# EAGLE design nixie_controller (EAGLE 9.4.0)

## Sheet 1 of 4: Controll
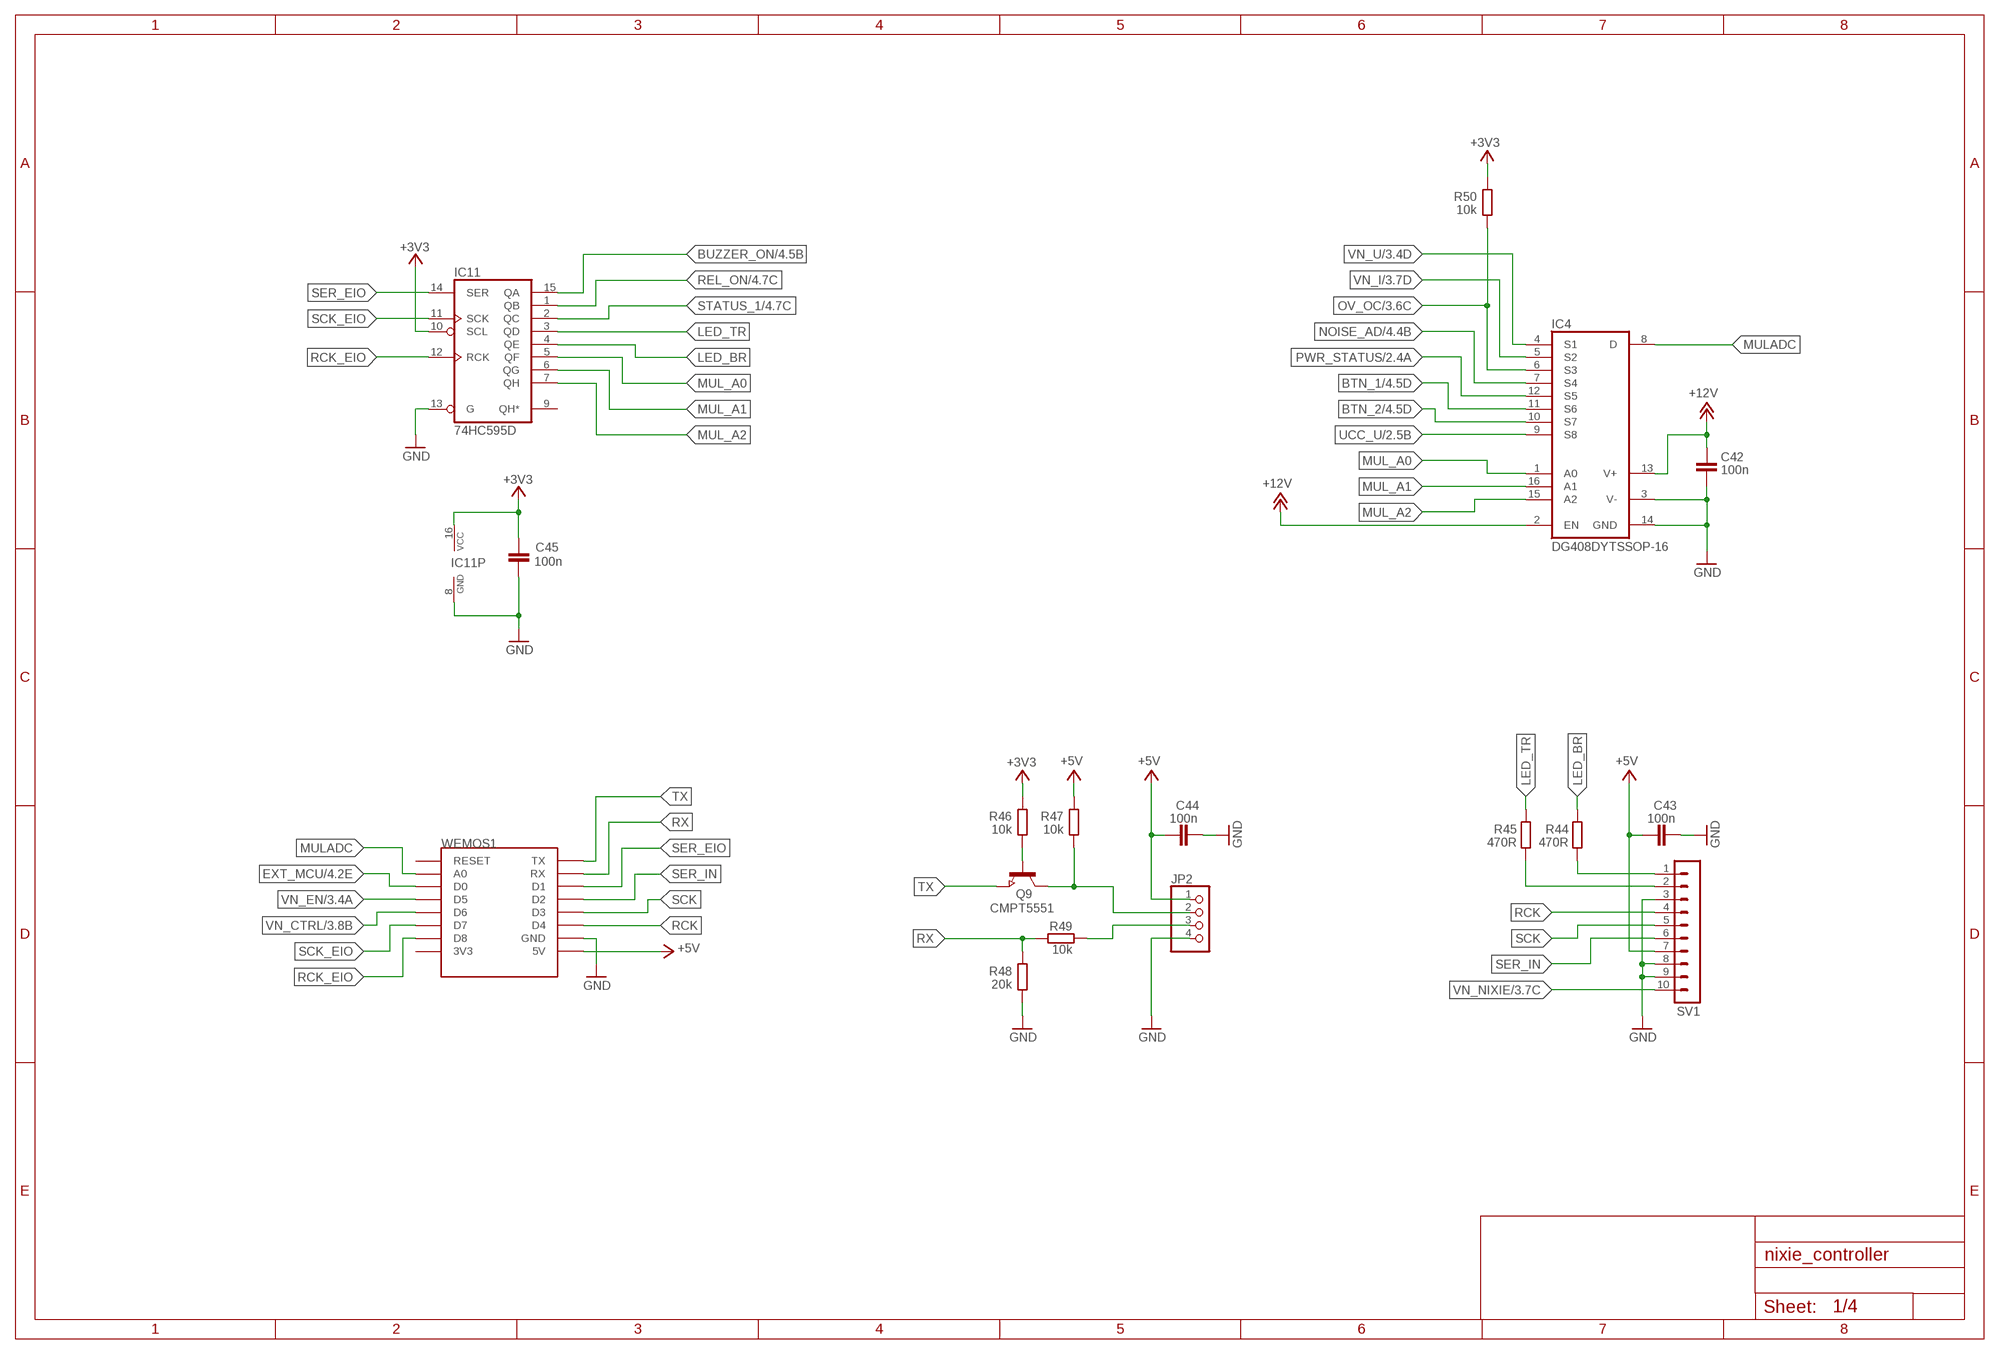
[diagram p0: schematic, sheet 1]

### Parts
C42  100n  C-EUC1206  [C1206]
C43  100n  C-EUC1206  [C1206]
C44  100n  C-EUC1206  [C1206]
C45  100n  C-EUC1206  [C1206]
IC4  DG408DYTSSOP-16  [TSSOP16]
IC11  74HC595D  [SO16]
JP2  PINHD-1X4/90  [1X04/90]
Q9  CMPT5551  NPN-TRANSISTOR_SOT23  [SOT23]
R44  470R  R-EU_R1206  [R1206]
R45  470R  R-EU_R1206  [R1206]
R46  10k  R-EU_R1206  [R1206]
R47  10k  R-EU_R1206  [R1206]
R48  20k  R-EU_R1206  [R1206]
R49  10k  R-EU_R1206  [R1206]
R50  10k  R-EU_R1206  [R1206]
SV1  MA10-1  [MA10-1]
WEMOS1  WEMOS-D1-MINI  [WEMOS-D1-MINI]

### Nets
+3V3: C45.1 IC11.10(SCL) IC11.16(VCC) R46.1 R50.1 ; also sheet 2,4
+5V: C43.1 C44.1 JP2.1 R47.1 SV1.7 WEMOS1.5V ; also sheet 2,3,4
+12V: C42.1 IC4.2(EN) IC4.13(V+) ; also sheet 2,4
BTN_1: IC4.11(S6) ; also sheet 4
BTN_2: IC4.10(S7) ; also sheet 4
BUZZER_ON: IC11.15(QA) ; also sheet 4
EXT_MCU: WEMOS1.D0 ; also sheet 4
GND: C42.2 C43.2 C44.2 C45.2 IC4.3(V-) IC4.14(GND) IC11.8(GND) IC11.13(G) JP2.4 R48.2 SV1.3 SV1.8 SV1.9 WEMOS1.GND ; also sheet 2,3,4
LED_B: R45.2 SV1.2
LED_BR: IC11.4(QE) R44.1
LED_T: R44.2 SV1.1
LED_TR: IC11.3(QD) R45.1
MUL_A0: IC4.1(A0) IC11.5(QF)
MUL_A1: IC4.16(A1) IC11.6(QG)
MUL_A2: IC4.15(A2) IC11.7(QH)
MULADC: IC4.8(D) WEMOS1.A0
N$60: Q9.1(B) R46.2
NOISE_AD: IC4.7(S4) ; also sheet 4
OV_OC: IC4.6(S3) R50.2 ; also sheet 3
PWR_STATUS: IC4.12(S5) ; also sheet 2
RCK: SV1.4 WEMOS1.D4
RCK_EIO: IC11.12(RCK) WEMOS1.D8
REL_ON: IC11.1(QB) ; also sheet 4
RX: R48.1 R49.1 WEMOS1.RX
RX_IN: JP2.3 R49.2
SCK: SV1.5 WEMOS1.D3
SCK_EIO: IC11.11(SCK) WEMOS1.D7
SER_EIO: IC11.14(SER) WEMOS1.D1
SER_IN: SV1.6 WEMOS1.D2
STATUS_1: IC11.2(QC) ; also sheet 4
TX: Q9.2(E) WEMOS1.TX
TX_IN: JP2.2 Q9.3(C) R47.2
UCC_U: IC4.9(S8) ; also sheet 2
VN_CTRL: WEMOS1.D6 ; also sheet 3
VN_EN: WEMOS1.D5 ; also sheet 3,4
VN_I: IC4.5(S2) ; also sheet 3
VN_NIXIE [VN]: SV1.10 ; also sheet 3
VN_U: IC4.4(S1) ; also sheet 3
Unconnected: IC11.9(QH*) WEMOS1.3V3 WEMOS1.RESET

## Sheet 2 of 4: Power
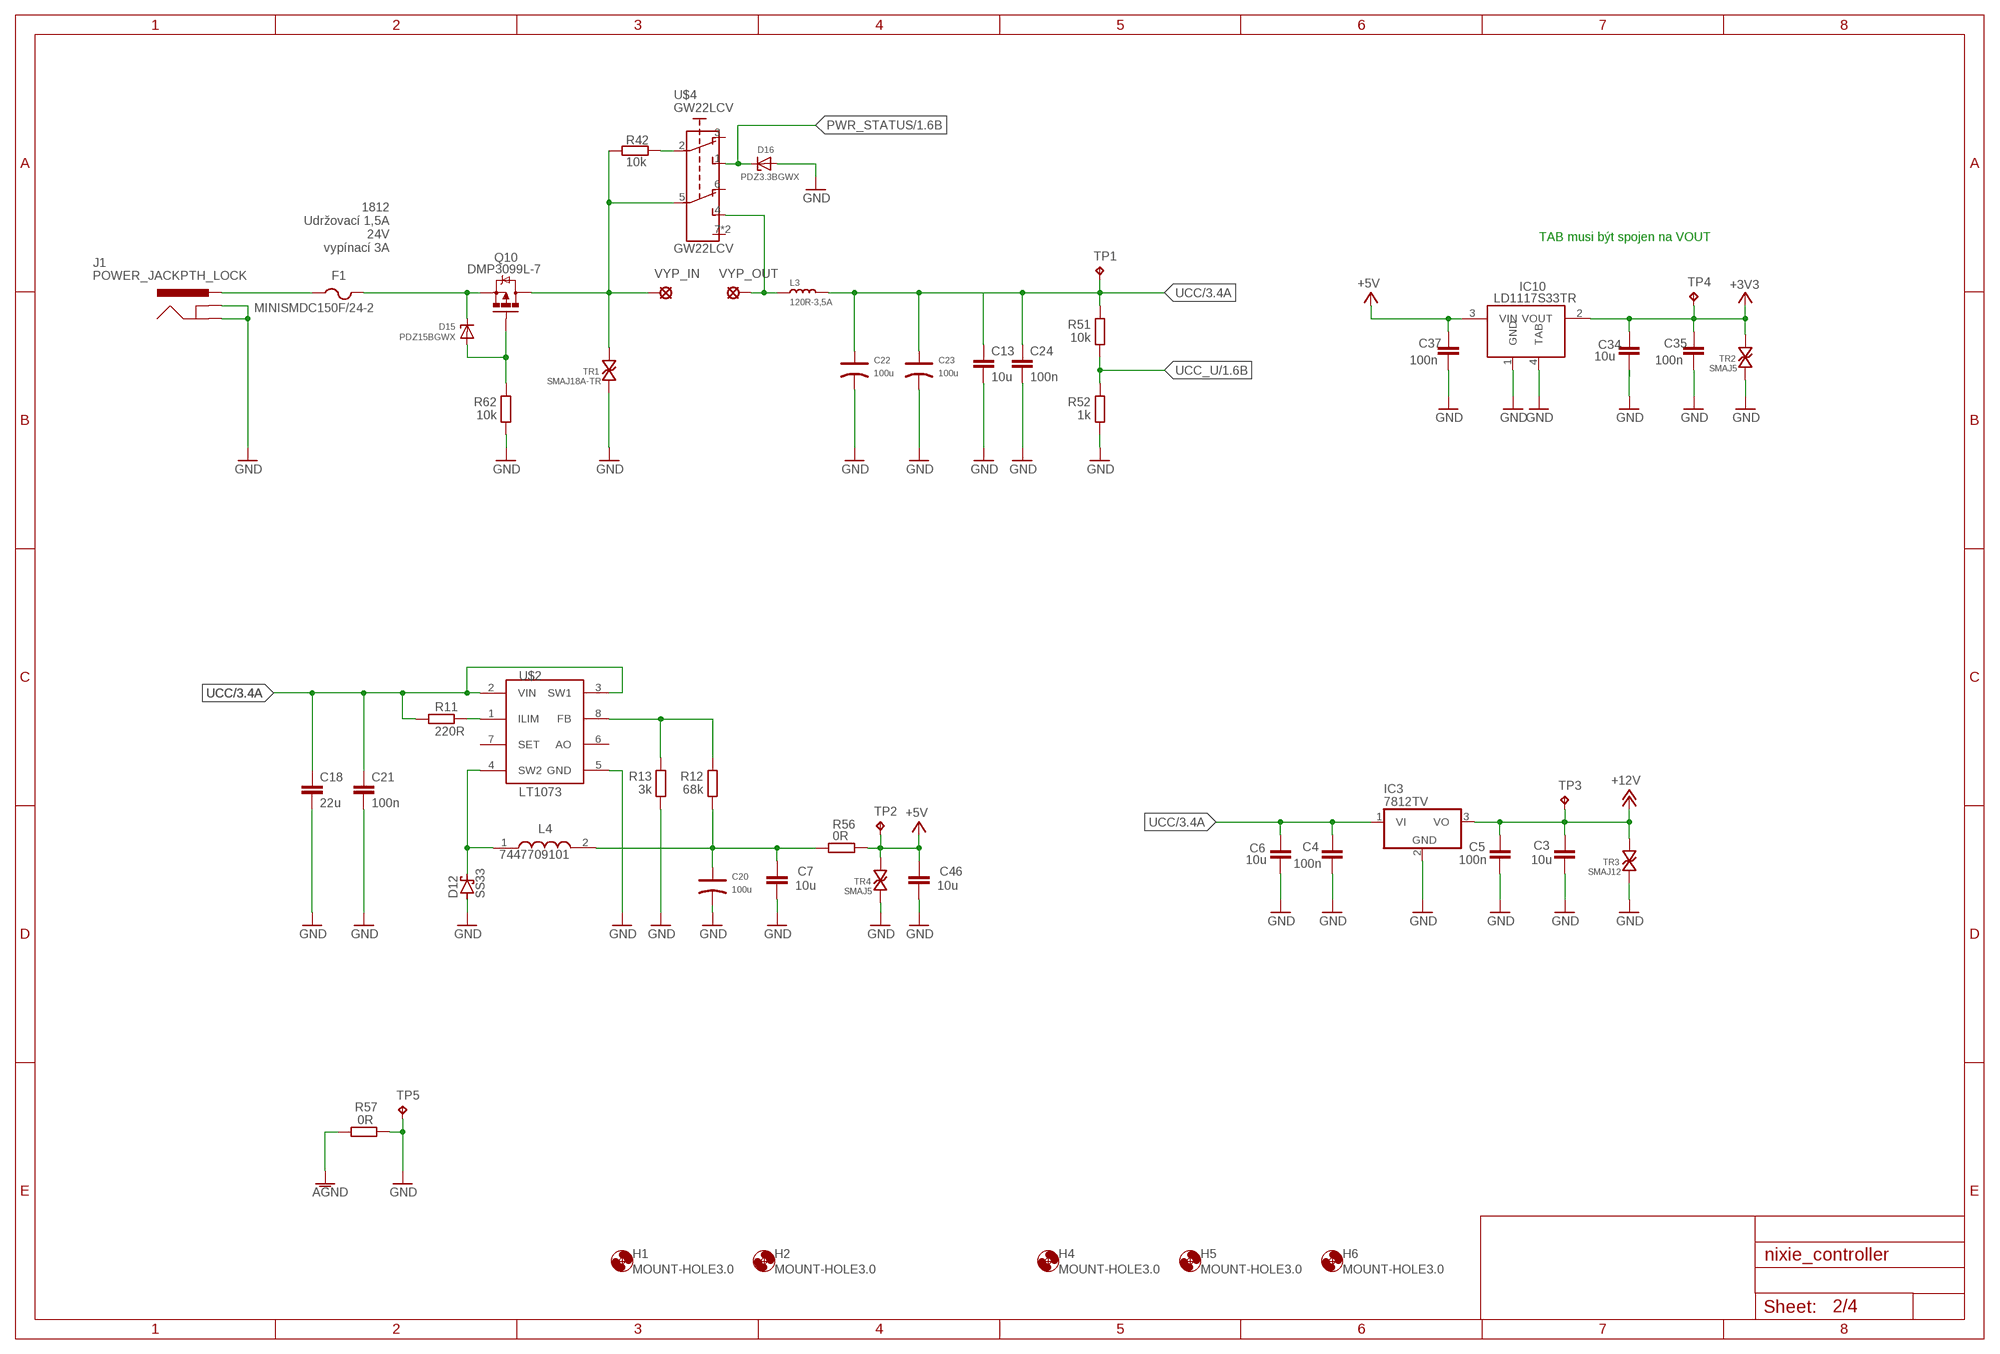
[diagram p1: schematic, sheet 2]

### Parts
C3  10u  C-EUC1206  [C1206]
C4  100n  C-EUC1206  [C1206]
C5  100n  C-EUC1206  [C1206]
C6  10u  C-EUC1206  [C1206]
C7  10u  C-EUC1206  [C1206]
C13  10u  C-EUC1206  [C1206]
C18  22u  C-EUC1206  [C1206]
C20  100u  ALUMINUM-SMD-220UF-16V(D6.3-H7.7MM)  [ELECTRO-SMD-C-6MM]
C21  100n  C-EUC1206  [C1206]
C22  100u  ALUMINUM-SMD-220UF-16V(D6.3-H7.7MM)  [ELECTRO-SMD-C-6MM]
C23  100u  ALUMINUM-SMD-220UF-16V(D6.3-H7.7MM)  [ELECTRO-SMD-C-6MM]
C24  100n  C-EUC1206  [C1206]
C34  10u  C-EUC1206  [C1206]
C35  100n  C-EUC1206  [C1206]
C37  100n  C-EUC1206  [C1206]
C46  10u  C-EUC1206  [C1206]
D12  SS33  SCHOTTKY-DIODESMC  [SMC]
D15  PDZ15BGWX  DIODESOD-123  [SOD-123]
D16  PDZ3.3BGWX  DIODESOD-123  [SOD-123]
F1  MINISMDC150F/24-2  PTCFUSE-1812  [1812]
H1  MOUNT-HOLE3.0  [3,0]
H2  MOUNT-HOLE3.0  [3,0]
H4  MOUNT-HOLE3.0  [3,0]
H5  MOUNT-HOLE3.0  [3,0]
H6  MOUNT-HOLE3.0  [3,0]
IC3  7812TV  [TO220V]
IC10  LD1117S33TR  [SOT230P700X180-4N]
J1  POWER_JACKPTH_LOCK  [POWER_JACK_PTH_LOCK]
L3  120R-3,5A  SMD-FERRITE-BEAD-470R-2A(0805)'0805'  [L0805]
L4  7447709101  [INDM120120X1000N]
Q10  DMP3099L-7  MOSFET-PCHANNEL  [SOT23-3]
R11  220R  R-EU_R1206  [R1206]
R12  68k  R-EU_R1206  [R1206]
R13  3k  R-EU_R1206  [R1206]
R42  10k  R-EU_R1206  [R1206]
R51  10k  R-EU_R1206  [R1206]
R52  1k  R-EU_R1206  [R1206]
R56  0R  R-EU_R1206  [R1206]
R57  0R  R-EU_R1206  [R1206]
R62  10k  R-EU_R1206  [R1206]
TP1  TPB1,27  [B1,27]
TP2  TPB1,27  [B1,27]
TP3  TPB1,27  [B1,27]
TP4  TPB1,27  [B1,27]
TP5  TPB1,27  [B1,27]
TR1  SMAJ18A-TR  SMAJ33CA-TR__DO214AC+MINIMELF  [DO214AC+MINIMELF_BIDIR]
TR2  SMAJ5  SMAJ33CA-TR__DO214AC+MINIMELF  [DO214AC+MINIMELF_BIDIR]
TR3  SMAJ12  SMAJ33CA-TR__DO214AC+MINIMELF  [DO214AC+MINIMELF_BIDIR]
TR4  SMAJ5  SMAJ33CA-TR__DO214AC+MINIMELF  [DO214AC+MINIMELF_BIDIR]
U$2  LT1073  [SOIC127P599X175-8]
U$4  GW22LCV  [GW22LCV]
VYP_IN  LSP11  [LSP11]
VYP_OUT  LSP11  [LSP11]

### Nets
+3V3: C34.1 C35.1 IC10.2(VOUT) TP4.TP TR2.P$2 ; also sheet 1,4
+5V: C37.1 C46.1 IC10.3(VIN) R56.1 TP2.TP TR4.P$2 ; also sheet 1,3,4
+12V: C3.1 C5.1 IC3.3(VO) TP3.TP TR3.P$2 ; also sheet 1,4
AGND: R57.2 ; also sheet 3,4
GND: C3.2 C4.2 C5.2 C6.2 C7.2 C13.2 C18.2 C20.- C21.2 C22.- C23.- C24.2 C34.2 C35.2 C37.2 C46.2 D12.A D16.A IC3.2(GND) IC10.1(GND) IC10.4(TAB) J1.GND J1.GNDBREAK R13.1 R52.1 R57.1 R62.1 TP5.TP TR1.P$1 TR2.P$1 TR3.P$1 TR4.P$1 U$2.5(GND) ; also sheet 1,3,4
N$3: D12.C L4.1 U$2.4(SW2)
N$14: F1.1 J1.PWR
N$15: L3.1 U$4.4(NO1) VYP_OUT.MP
N$28: R11.2 U$2.1(ILIM)
N$31: R12.2 R13.2 U$2.8(FB)
N$35: Q10.3(D) R42.2 TR1.P$2 U$4.5(COM1) VYP_IN.MP
N$38: C7.1 C20.+ L4.2 R12.1 R56.2
N$58: D15.C F1.2 Q10.2(S)
N$61: R42.1 U$4.2(COM)
N$63: D15.A Q10.1(G) R62.2
PWR_STATUS: D16.C U$4.1(NO) ; also sheet 1
UCC: C4.1 C6.1 C13.1 C18.1 C21.1 C22.+ C23.+ C24.1 IC3.1(VI) L3.2 R11.1 R51.2 TP1.TP U$2.2(VIN) U$2.3(SW1) ; also sheet 3
UCC_U: R51.1 R52.2 ; also sheet 1
Unconnected: U$2.6(AO) U$2.7(SET) U$4.3(NC) U$4.6(NC1)

### Notes on the sheet
- 1812
  Udržovací 1,5A
  24V
  vypínací 3A
- TAB musi být spojen na VOUT
- GW22LCV

## Sheet 3 of 4: High voltage source for Nixies
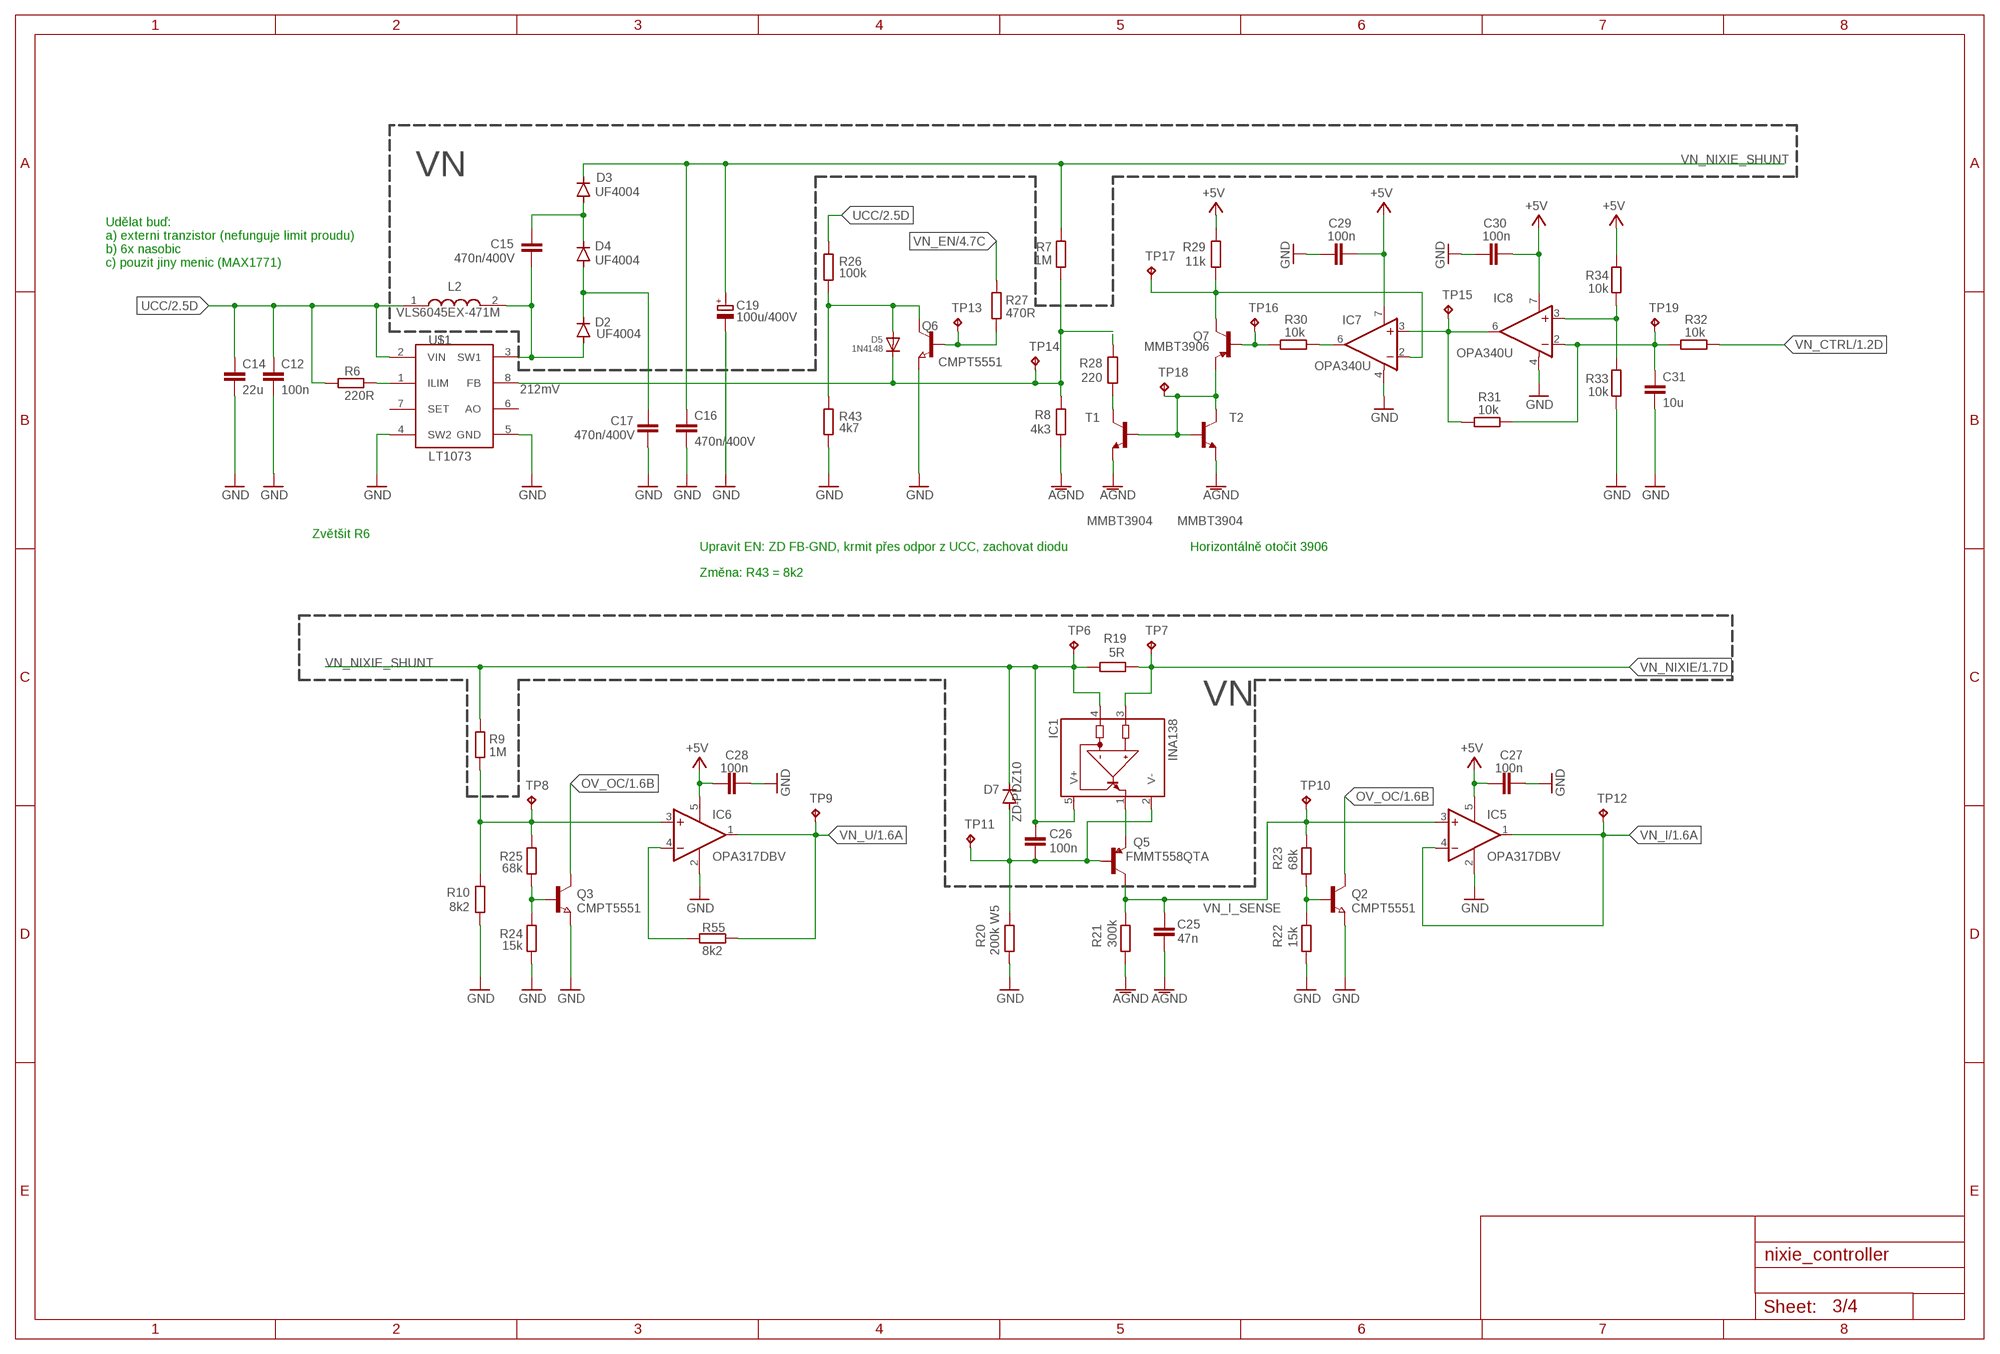
[diagram p2: schematic, sheet 3]

### Parts
C12  100n  C-EUC1206  [C1206]
C14  22u  C-EUC1206  [C1206]
C15  470n/400V  C-EUC1812  [C1812]
C16  470n/400V  C-EUC1812  [C1812]
C17  470n/400V  C-EUC1812  [C1812]
C19  100u/400V  CPOL_E51X21  [E51-22]
C25  47n  C-EUC1206  [C1206]
C26  100n  C-EUC1206  [C1206]
C27  100n  C-EUC1206  [C1206]
C28  100n  C-EUC1206  [C1206]
C29  100n  C-EUC1206  [C1206]
C30  100n  C-EUC1206  [C1206]
C31  10u  C-EUC1206  [C1206]
D2  UF4004  DIODE-DO41-10  [DO41-10]
D3  UF4004  DIODE-DO41-10  [DO41-10]
D4  UF4004  DIODE-DO41-10  [DO41-10]
D5  1N4148  DIODESOD-123  [SOD-123]
D7  ZD-PDZ10  DIODE-SOD123  [SOD123]
IC1  INA138  [SOT23-5]
IC5  OPA317DBV  TS931ILT  [SOT23-5]
IC6  OPA317DBV  TS931ILT  [SOT23-5]
IC7  OPA340U  [SO08]
IC8  OPA340U  [SO08]
L2  VLS6045EX-471M  [INDPM6060X450N]
Q2  CMPT5551  NPN-TRANSISTOR_SOT23  [SOT23]
Q3  CMPT5551  NPN-TRANSISTOR_SOT23  [SOT23]
Q5  FMMT558QTA  TRANSISTOR_PNPSMD  [SOT23-3]
Q6  CMPT5551  NPN-TRANSISTOR_SOT23  [SOT23]
Q7  MMBT3906  TRANSISTOR_PNPSMD  [SOT23-3]
R6  220R  R-EU_R1206  [R1206]
R7  1M  R-EU_R1206  [R1206]
R8  4k3  R-EU_R1206  [R1206]
R9  1M  R-EU_R1206  [R1206]
R10  8k2  R-EU_R1206  [R1206]
R19  5R  R-EU_R1206  [R1206]
R20  200k W5  R-EU_R1206  [R1206]
R21  300k  R-EU_R1206  [R1206]
R22  15k  R-EU_R1206  [R1206]
R23  68k  R-EU_R1206  [R1206]
R24  15k  R-EU_R1206  [R1206]
R25  68k  R-EU_R1206  [R1206]
R26  100k  R-EU_R1206  [R1206]
R27  470R  R-EU_R1206  [R1206]
R28  220  R-EU_R1206  [R1206]
R29  11k  R-EU_R1206  [R1206]
R30  10k  R-EU_R1206  [R1206]
R31  10k  R-EU_R1206  [R1206]
R32  10k  R-EU_R1206  [R1206]
R33  10k  R-EU_R1206  [R1206]
R34  10k  R-EU_R1206  [R1206]
R43  4k7  R-EU_R1206  [R1206]
R55  8k2  R-EU_R1206  [R1206]
T1  MMBT3904  MMBT3904LT1-NPN-SOT23-BEC  [SOT23-BEC]
T2  MMBT3904  MMBT3904LT1-NPN-SOT23-BEC  [SOT23-BEC]
TP6  TPB1,27  [B1,27]
TP7  TPB1,27  [B1,27]
TP8  TPB1,27  [B1,27]
TP9  TPB1,27  [B1,27]
TP10  TPB1,27  [B1,27]
TP11  TPB1,27  [B1,27]
TP12  TPB1,27  [B1,27]
TP13  TPB1,27  [B1,27]
TP14  TPB1,27  [B1,27]
TP15  TPB1,27  [B1,27]
TP16  TPB1,27  [B1,27]
TP17  TPB1,27  [B1,27]
TP18  TPB1,27  [B1,27]
TP19  TPB1,27  [B1,27]
U$1  LT1073  [SOIC127P599X175-8]

### Nets
+5V: C27.1 C28.1 C29.1 C30.1 IC5.5(V+) IC6.5(V+) IC7.7(V+) IC8.7(V+) R29.2 R34.1 ; also sheet 1,2,4
AGND: C25.2 R8.1 R21.2 T1.E T2.E ; also sheet 2,4
GND: C12.2 C14.2 C16.2 C17.2 C19.- C27.2 C28.2 C29.2 C30.2 C31.2 IC5.2(V-) IC6.2(V-) IC7.4(V-) IC8.4(V-) Q2.2(E) Q3.2(E) Q6.2(E) R10.1 R20.2 R22.2 R24.2 R33.2 R43.2 U$1.4(SW2) U$1.5(GND) ; also sheet 1,2,4
N$6: IC6.4(-IN) R55.2
N$22: R6.2 U$1.1(ILIM)
N$23 [VN]: C15.1 D2.A L2.2 U$1.3(SW1)
N$24 [VN]: C15.2 D3.A D4.C
N$25 [VN]: C17.1 D2.C D4.A
N$27: Q2.1(B) R22.1 R23.2
N$29: Q3.1(B) R24.1 R25.2
N$41: Q6.1(B) R27.2 TP13.TP
N$42 [VN]: C26.2 D7.A IC1.2(V-) Q5.1(B) R20.1 TP11.TP
N$43 [VN]: IC1.1(OUT) Q5.2(E)
N$45: C31.1 IC8.2(-IN) R31.1 R32.2 TP19.TP
N$46: R28.1 T1.C
N$47: Q7.2(E) T1.B T2.B T2.C TP18.TP
N$48: IC7.3(+IN) IC8.6(OUT) R31.2 TP15.TP
N$49: IC8.3(+IN) R33.1 R34.2
N$50: Q7.1(B) R30.2 TP16.TP
N$51: IC7.6(OUT) R30.1
N$52: IC7.2(-IN) Q7.3(C) R29.1 TP17.TP
N$59: D5.A Q6.3(C) R26.2 R43.1
OV_OC: Q2.3(C) Q3.3(C) ; also sheet 1
SW_FB: D5.C R7.1 R8.2 R28.2 TP14.TP U$1.8(FB)
UCC: C12.1 C14.1 L2.1 R6.1 R26.1 U$1.2(VIN) ; also sheet 2
VN_CTRL: R32.1 ; also sheet 1
VN_EN: R27.1 ; also sheet 1,4
VN_I: IC5.1(OUT) IC5.4(-IN) TP12.TP ; also sheet 1
VN_I_SENSE: C25.1 IC5.3(+IN) Q5.3(C) R21.1 R23.1 TP10.TP
VN_NIXIE [VN]: IC1.3(IN+) R19.1 TP7.TP ; also sheet 1
VN_NIXIE_SHUNT [VN]: C16.1 C19.+ C26.1 D3.C D7.C IC1.4(IN-) IC1.5(V+) R7.2 R9.2 R19.2 TP6.TP
VN_U: IC6.1(OUT) R55.1 TP9.TP ; also sheet 1
VN_U_SENSE: IC6.3(+IN) R9.1 R10.2 R25.1 TP8.TP
Unconnected: U$1.6(AO) U$1.7(SET)

### Notes on the sheet
- VN
- Udělat buď:
  a) externi tranzistor (nefunguje limit proudu)
  b) 6x nasobic
  c) pouzit jiny menic (MAX1771)
- 212mV
- Zvětšit R6
- Upravit EN: ZD FB-GND, krmit přes odpor z UCC, zachovat diodu | Horizontálně otočit 3906
- Změna: R43 = 8k2
- VN

## Sheet 4 of 4: Extended IO
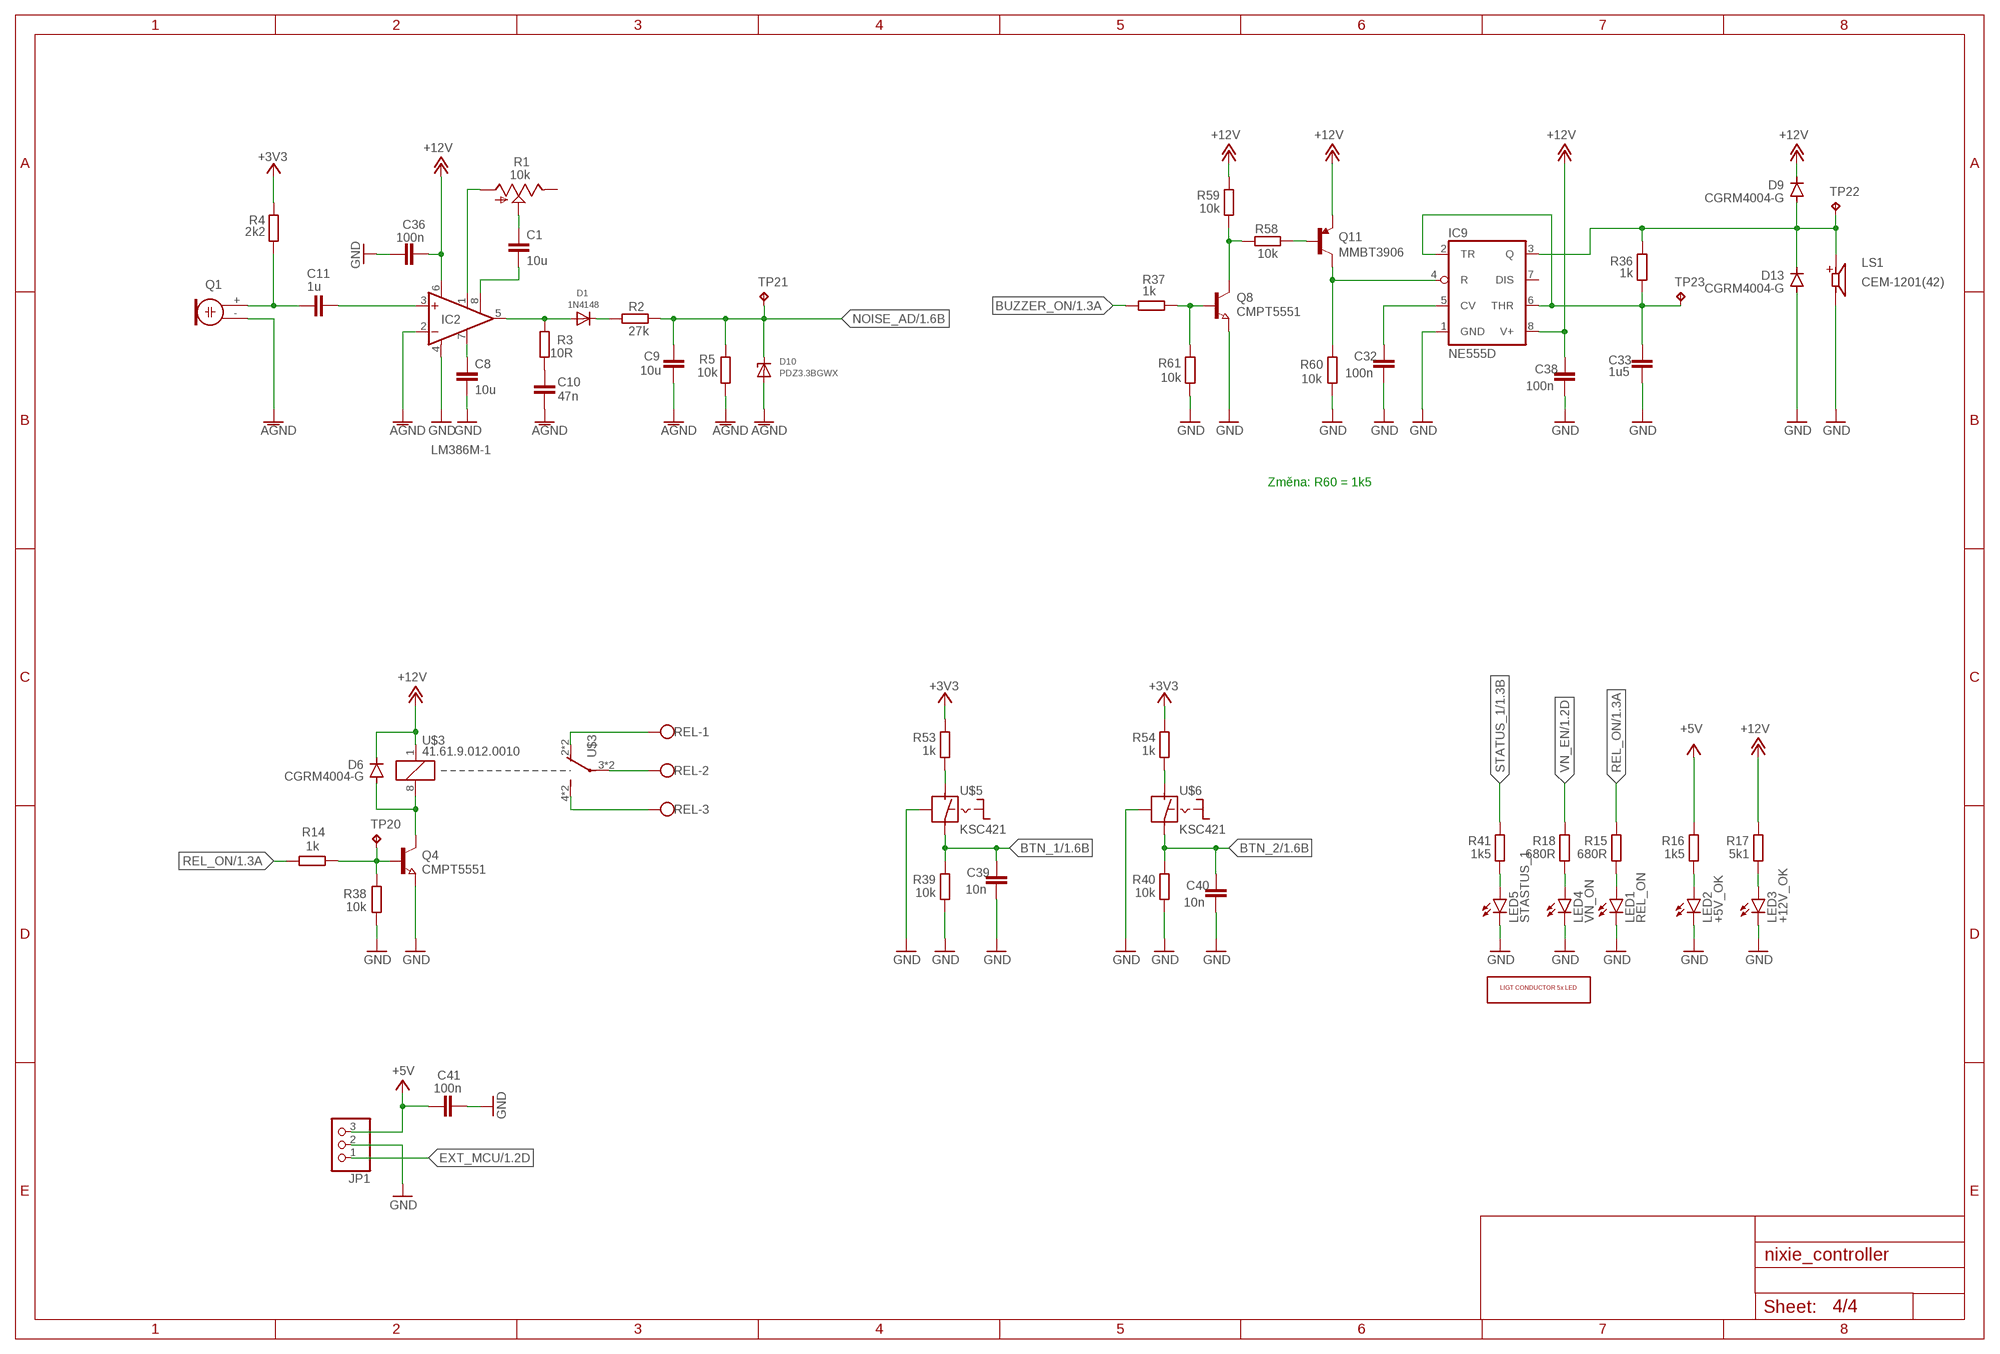
[diagram p3: schematic, sheet 4]

### Parts
C1  10u  C-EUC1206  [C1206]
C8  10u  C-EUC1206  [C1206]
C9  10u  C-EUC1206  [C1206]
C10  47n  C-EUC1206  [C1206]
C11  1u  C-EUC1206  [C1206]
C32  100n  C-EUC1206  [C1206]
C33  1u5  C-EUC1206  [C1206]
C36  100n  C-EUC1206  [C1206]
C38  100n  C-EUC1206  [C1206]
C39  10n  C-EUC1206  [C1206]
C40  10n  C-EUC1206  [C1206]
C41  100n  C-EUC1206  [C1206]
D1  1N4148  DIODESOD-123  [SOD-123]
D6  CGRM4004-G  [SOD-123_MINI-SMA]
D9  CGRM4004-G  [SOD-123_MINI-SMA]
D10  PDZ3.3BGWX  DIODESOD-123  [SOD-123]
D13  CGRM4004-G  [SOD-123_MINI-SMA]
IC2  LM386M-1  [SO08]
IC9  NE555D  [SO08]
JP1  PINHD-1X3/90  [1X03/90]
LED1  REL_ON  LEDCHIP-LED0805  [CHIP-LED0805]
LED2  +5V_OK  LEDCHIP-LED0805  [CHIP-LED0805]
LED3  +12V_OK  LEDCHIP-LED0805  [CHIP-LED0805]
LED4  VN_ON  LEDCHIP-LED0805  [CHIP-LED0805]
LED5  STASTUS_1  LEDCHIP-LED0805  [CHIP-LED0805]
LS1  CEM-1201(42)  [CUI_CEM-1201(42)]
Q1  ELECTRET  [9.7ELECTRET]
Q4  CMPT5551  NPN-TRANSISTOR_SOT23  [SOT23]
Q8  CMPT5551  NPN-TRANSISTOR_SOT23  [SOT23]
Q11  MMBT3906  TRANSISTOR_PNPSMD  [SOT23-3]
R1  10k  TRIM_US-RJ9W  [RJ9W]
R2  27k  R-EU_R1206  [R1206]
R3  10R  R-EU_R1206  [R1206]
R4  2k2  R-EU_R1206  [R1206]
R5  10k  R-EU_R1206  [R1206]
R14  1k  R-EU_R1206  [R1206]
R15  680R  R-EU_R1206  [R1206]
R16  1k5  R-EU_R1206  [R1206]
R17  5k1  R-EU_R1206  [R1206]
R18  680R  R-EU_R1206  [R1206]
R36  1k  R-EU_R1206  [R1206]
R37  1k  R-EU_R1206  [R1206]
R38  10k  R-EU_R1206  [R1206]
R39  10k  R-EU_R1206  [R1206]
R40  10k  R-EU_R1206  [R1206]
R41  1k5  R-EU_R1206  [R1206]
R53  1k  R-EU_R1206  [R1206]
R54  1k  R-EU_R1206  [R1206]
R58  10k  R-EU_R1206  [R1206]
R59  10k  R-EU_R1206  [R1206]
R60  10k  R-EU_R1206  [R1206]
R61  10k  R-EU_R1206  [R1206]
REL  W237-103  [W237-103]
TP20  TPB1,27  [B1,27]
TP21  TPB1,27  [B1,27]
TP22  TPB1,27  [B1,27]
TP23  TPB1,27  [B1,27]
U$3  41.61.9.012.0010  [41.52]
U$5  KSC421  [KSC421V]
U$6  KSC421  [KSC421V]
U$7  LIGT_CONDUCT_5LED  [LC_5LED]

### Nets
+3V3: R4.2 R53.2 R54.2 ; also sheet 1,2
+5V: C41.2 JP1.3 R16.2 ; also sheet 1,2,3
+12V: C36.2 C38.1 D6.C D9.C IC2.6(VS) IC9.8(V+) Q11.2(E) R17.2 R59.2 U$3.1 ; also sheet 1,2
AGND: C9.2 C10.2 D10.A IC2.2(-IN) Q1.- R5.1 ; also sheet 2,3
BTN_1: C39.1 R39.2 U$5.P$1(P) ; also sheet 1
BTN_2: C40.1 R40.2 U$6.P$1(P) ; also sheet 1
BUZZER_ON: R37.2 ; also sheet 1
EXT_MCU: JP1.1 ; also sheet 1
GND: C8.2 C32.2 C33.2 C36.1 C38.2 C39.2 C40.2 C41.1 D13.A IC2.4(GND) IC9.1(GND) JP1.2 LED1.C LED2.C LED3.C LED4.C LED5.C LS1.M Q4.2(E) Q8.2(E) R38.2 R39.1 R40.1 R60.1 R61.1 U$5.P$3(GND) U$5.P$4(GND) U$5.P$5(GND) U$5.P$6(GND) U$5.P$7(GND) U$5.P$8(GND) U$6.P$3(GND) U$6.P$4(GND) U$6.P$5(GND) U$6.P$6(GND) U$6.P$7(GND) U$6.P$8(GND) ; also sheet 1,2,3
N$1: D1.C R2.1
N$2: C33.1 IC9.2(TR) IC9.6(THR) R36.1 TP23.TP
N$4: R53.1 U$5.P$2(S)
N$5: R54.1 U$6.P$2(S)
N$7: D6.A Q4.3(C) U$3.8
N$8 [VN]: REL.1 U$3.2(O) U$3.7(O)
N$9 [VN]: REL.2 U$3.3(P) U$3.6(P)
N$10: C8.1 IC2.7(BYPASS)
N$11: C10.1 R3.1
N$12: C11.1 Q1.+ R4.1
N$13: C1.2 IC2.8(GAIN)
N$16: IC2.1(GAIN) R1.A
N$17: C1.1 R1.S
N$18: C11.2 IC2.3(+IN)
N$19: LED2.A R16.1
N$20: D1.A IC2.5(OUT) R3.2
N$30 [VN]: REL.3 U$3.4(S) U$3.5(S)
N$32: LED3.A R17.1
N$33: Q4.1(B) R14.1 R38.1 TP20.TP
N$34: LED1.A R15.1
N$39: IC9.4(R) Q11.3(C) R60.2
N$40: LED4.A R18.1
N$44: C32.1 IC9.5(CV)
N$53: Q11.1(B) R58.2
N$54: D9.A D13.C IC9.3(Q) LS1.P R36.2 TP22.TP
N$55: Q8.3(C) R58.1 R59.1
N$56: LED5.A R41.1
N$57: Q8.1(B) R37.1 R61.2
NOISE_AD: C9.1 D10.C R2.2 R5.2 TP21.TP ; also sheet 1
REL_ON: R14.2 R15.2 ; also sheet 1
STATUS_1: R41.2 ; also sheet 1
VN_EN: R18.2 ; also sheet 1,3
Unconnected: IC9.7(DIS) R1.E

### Notes on the sheet
- Změna: R60 = 1k5

## Power pins joined to a net without a drawn wire
P$1: U$4.7 U$4.8

## Library data of the parts
C1 C3-C18 C21 C24-C46 = rcl:C-EU: CAPACITOR, European symbol; SPICEPREFIX: C
C19 = C:CPOL_E51X21
C20 C22 C23 = Seeed-Capacitor:ALUMINUM-SMD-220UF-16V(D6.3-H7.7MM): 302030053; MPN: CS1E221M-CRE77; VALUE: 220UF
D1 D5 D10 D15 D16 = adafruit:DIODE: Diode SMADIODE - SMA Surface Mount Package 20V 1A Schottky Diode Digikey: 641-1014-6-ND DO-1N4148 - Through Hole Small Current Diode SOD-123 20V 1 A (.5mV Vf) Schottky Diode - Digikey: MBRX120TPMSCT-ND SOD-323 10V 570mA (.38mV Vf, 3ns) Schottky Diode - Digikey: ZLLS410CT-ND SOD-523 30V 30mA Schottky Diode (RB751S-40TE61) - Digikey: RB751S-40TE61CT-ND SOT23-R/W - SOT23 Package (R = Solder Paste/Reflow Ovens, W = Hand-Soldering) BAT54Film 40V 300mA - Digikey: 497-7162-1-ND
D2-D4 D7 = diode:DIODE-: DIODE
D6 D9 D13 = diode:CGRM400*-G: Molded plasitc,JEDEC SOD-123/Mini SMA Source: Comchip CGRM4001-G.pdf
D12 = diode:SCHOTTKY-DIODE: Schottky Diode
F1 = adafruit:PTCFUSE: PTC fuses, resettable thermistors
H1 H2 H4-H6 = holes:MOUNT-HOLE: MOUNTING HOLE with drill center marker
IC1 = burr-brown:INA138: High-Side Measurement Current Shunt Monitor; MF: TEXAS INSTRUMENTS; MPN: INA138NA/250; OC_FARNELL: 1564888; OC_NEWARK: 80K5906
IC2 = linear:LM386?-*: Low Voltage Audio Power Amplifier Source: http://cache.national.com/ds/LM/LM386.pdf
IC3 = linear:78*: Positive VOLTAGE REGULATOR Source: http://cache.national.com/ds/LM/LM78L05.pdf http://www.fairchildsemi.com/ds/LM/LM7805.pdf
IC4 = maxim_sTSSOP16:DG408DY: ANALOG MULTIPLEXER
IC5 IC6 = linear:TS931?*: Output rail-to-rail micropower operational amplifiers Source: http://www.st.com/st-web-ui/static/active/en/resource/technical/document/datasheet/CD00001973.pdf
IC7 IC8 = burr-brown:OPA340: Rail-to-Rail Operational Amplifiers Single-Supply, MicroAmplifier(TM) Series; MPN: OPA340UA; OC_FARNELL: 1106196; OC_NEWARK: 24M5449
IC9 = adafruit:*555: TIMER Changed DIP package to have round (not oval) pin pads http://www.ladyada.net/library/pcb/eaglelibrary.html
IC10 = SamacSys_Parts:LD1117S33TR: LD1117S33TR, Low Dropout Voltage Regulator, 1.3A, 3.3 V +/-1%, 4-Pin SOT-223 Source: Datasheet <https://componentsearchengine.com/Datasheets/1/LD1117S33TR.pdf>; DESCRIPTION: LD1117S33TR, Low Dropout Voltage Regulator, 1.3A, 3.3 V +/-1%, 4-Pin SOT-223; HEIGHT: 1.8mm; MANUFACTURER_NAME: STMicroelectronics; MANUFACTURER_PART_NUMBER: LD1117S33TR; MOUSER_PART_NUMBER: 511-LD1117S33; MOUSER_PRICE-STOCK: https://www.mouser.com/Search/Refine.aspx?Keyword=511-LD1117S33
IC11 = 74xx-eu:74*595: 8-bit SHIFT REGISTER, output latch
J1 = SparkFun-Connectors:POWER_JACK: Power Jack Connector This is the standard 5.5mm barrel jack for power. The PTH is the most common, proven, reliable, footprint. The Slot footprint only works if the mill layer is transmitted to the PCB fab house so be warned. Here are the connectors we sell at SparkFun: DC Barrel Power Jack/Connector <https://www.sparkfun.com/products/119> (PRT-00119) DC Barrel Power Jack/Connector (SMD) <https://www.sparkfun.com/products/12748> (PRT-12748) DC Barrel Jack Adapter - Breadboard Compatible <https://www.sparkfun.com/products/10811> (PRT-10811) It is used on this SparkFun product (and many, many others): SparkFun RedBoard - Programmed with Arduino <https://www.sparkfun.com/products/12757> (DEV-12757) Also, if you need a mating power supply or connector, please check these out: Wall Adapter Power Supply - 9VDC 650mA <https://www.sparkfun.com/products/298> (TOL-00298) DC Barrel Jack Adapter - Male <https://www.sparkfun.com/products/10287> (PRT-10287); PROD_ID: CONN-08197; SF_ID: PRT-00119
JP1 = pinhead:PINHD-1X3: PIN HEADER
JP2 = pinhead:PINHD-1X4: PIN HEADER
L2 = VLS6045EX-471M:VLS6045EX-471M: Fixed Inductors 470uH 20% 2.14ohms 0.4A Wound Ferrite Source: Datasheet <https://product.tdk.com/info/en/catalog/datasheets/inductor_commercial_power_vls6045ex_en.pdf>; DESCRIPTION: Fixed Inductors 470uH 20% 2.14ohms 0.4A Wound Ferrite; HEIGHT: 4.5mm; MANUFACTURER_NAME: TDK; MANUFACTURER_PART_NUMBER: VLS6045EX-471M; MOUSER_PART_NUMBER: 810-VLS6045EX-471M; MOUSER_PRICE-STOCK: https://www.mouser.com/Search/Refine.aspx?Keyword=810-VLS6045EX-471M
L3 = Seeed-Inductor:SMD-FERRITE-BEAD-470R-2A(0805): 303030008; MPN: WLB2012-471T20; VALUE: 470R-2A
L4 = SamacSys_Parts:7447709101: Fixed Inductors WE-PD 1210 100uH 2.5A .11Ohm Source: Datasheet <https://componentsearchengine.com/Datasheets/1/7447709101.pdf>; DESCRIPTION: Fixed Inductors WE-PD 1210 100uH 2.5A .11Ohm; HEIGHT: 10mm; MANUFACTURER_NAME: Wurth Elektronik; MANUFACTURER_PART_NUMBER: 7447709101; MOUSER_PART_NUMBER: 710-7447709101; MOUSER_PRICE-STOCK: https://www.mouser.com/Search/Refine.aspx?Keyword=710-7447709101
LED1-LED5 = led:LED: LED OSRAM: - CHIPLED LG R971, LG N971, LY N971, LG Q971, LY Q971, LO R971, LY R971 LH N974, LH R974 LS Q976, LO Q976, LY Q976 LO Q996 - Hyper CHIPLED LW Q18S LB Q993, LB Q99A, LB R99A - SideLED LS A670, LO A670, LY A670, LG A670, LP A670 LB A673, LV A673, LT A673, LW A673 LH A674 LY A675 LS A676, LA A676, LO A676, LY A676, LW A676 LS A679, LY A679, LG A679 - Hyper Micro SIDELED® LS Y876, LA Y876, LO Y876, LY Y876 LT Y87S - SmartLED LW L88C, LW L88S LB L89C, LB L89S, LG L890 LS L89K, LO L89K, LY L89K LS L896, LA L896, LO L896, LY L896 - TOPLED LS T670, LO T670, LY T670, LG T670, LP T670 LSG T670, LSP T670, LSY T670, LOP T670, LYG T670 LG T671, LOG T671, LSG T671 LB T673, LV T673, LT T673, LW T673 LH T674 LS T676, LA T676, LO T676, LY T676, LB T676, LH T676, LSB T676, LW T676 LB T67C, LV T67C, LT T67C, LS T67K, LO T67K, LY T67K, LW E67C LS E67B, LA E67B, LO E67B, LY E67B, LB E67C, LV E67C, LT E67C LW T67C LS T679, LY T679, LG T679 LS T770, LO T770, LY T770, LG T770, LP T770 LB T773, LV T773, LT T773, LW T773 LH T774 LS E675, LA E675, LY E675, LS T675 LS T776, LA T776, LO T776, LY T776, LB T776 LHGB T686 LT T68C, LB T68C - Hyper Mini TOPLED® LB M676 - Mini TOPLED Santana® LG M470 LS M47K, LO M47K, LY M47K Source: http://www.osram.convergy.de LUXEON: - LUMILED® LXK2-PW12-R00, LXK2-PW12-S00, LXK2-PW14-U00, LXK2-PW14-V00 LXK2-PM12-R00, LXK2-PM12-S00, LXK2-PM14-U00 LXK2-PE12-Q00, LXK2-PE12-R00, LXK2-PE12-S00, LXK2-PE14-T00, LXK2-PE14-U00 LXK2-PB12-K00, LXK2-PB12-L00, LXK2-PB12-M00, LXK2-PB14-N00, LXK2-PB14-P00, LXK2-PB14-Q00 LXK2-PR12-L00, LXK2-PR12-M00, LXK2-PR14-Q00, LXK2-PR14-R00 LXK2-PD12-Q00, LXK2-PD12-R00, LXK2-PD12-S00 LXK2-PH12-R00, LXK2-PH12-S00 LXK2-PL12-P00, LXK2-PL12-Q00, LXK2-PL12-R00 Source: www.luxeon.com KINGBRIGHT: KA-3528ASYC Source: www.kingbright.com
LS1 = CEM-1201_42_:CEM-1201(42): Audio Buzzer Magnetic 1Vo-p 2Vo-p 20mA 1.5Vo-p 85dBA Pin Through Hole Tray; MANUFACTURER: CUI INC; STANDARD: Manufacturer recommendations
Q1 = adafruit:ELECTRET: Electret microphone Thru hole 2.54mm spacing with 9.7mm diameter
Q2-Q4 Q6 Q8 Q9 = semicon-smd-ipc:NPN-TRANSISTOR_: NPN TRANSISTOR
Q5 Q7 Q11 = User-Submitted:TRANSISTOR_PNP: Generic PNP BJT Double check pinouts against datasheets- not all devices are the same! MMBT3906 - 40V 200mA SOT-23 (TRANS-08052) MMBT4403 - 40V 600mA SOT-23 (TRANS-09245)
Q10 = User-Submitted:MOSFET-PCHANNEL: Generic PMOSFET IRLML2244 - TRANS-11153 (SOT-23 -20V -4.3A) (1.Gate 2.Source 3.Drain) FQP27P06 - COM-10349 <http://www.sparkfun.com/products/10349> (TO-220 -60V -27A) (1.Gate 2.Source 3.Drain); PROD_ID: TRANS-08285
R1 = pot:TRIM_US-: POTENTIOMETER
R2-R34 R36-R62 = rcl:R-EU_: RESISTOR, European symbol; SPICEPREFIX: R
REL = con-wago-500:W237-103: WAGO SCREW CLAMP; MPN: 237-103; OC_FARNELL: unknown; OC_NEWARK: 18M7116
SV1 = con-lstb:MA10-1: PIN HEADER; OC_FARNELL: unknown; OC_NEWARK: unknown
T1 T2 = DC_LOAD_AU:*-NPN-: NPN Transistror BF959 corrected 2008.03.06
TP1-TP23 = testpad:TP: Test pad
TR1-TR4 = transil:SMAJ33CA-TR__DO214AC+MINIMELF: Transil SMAJ 33 Volt BIDIR. DO214AC+MINIMELF Package.
U$1 U$2 = nixie:LT1073
U$3 = 41.52.9.024.0010:41.61.9.012.0010
U$4 = 41.52.9.024.0010:GW22LCV: https://cz.mouser.com/datasheet/2/295/GW-25995.pdf
U$5 U$6 = 41.52.9.024.0010:KSC421
U$7 = 41.52.9.024.0010:LIGT_CONDUCT_5LED
VYP_IN VYP_OUT = solpad:LSP11: SOLDER PAD drill 1.1 mm
WEMOS1 = esp8266modules:WEMOS-D1-MINI: WeMos.cc D1 mini ESP8266 module

## Net classes
1 VN: clearance 1.2 mm to class 0, clearance 0.25 mm

## Board
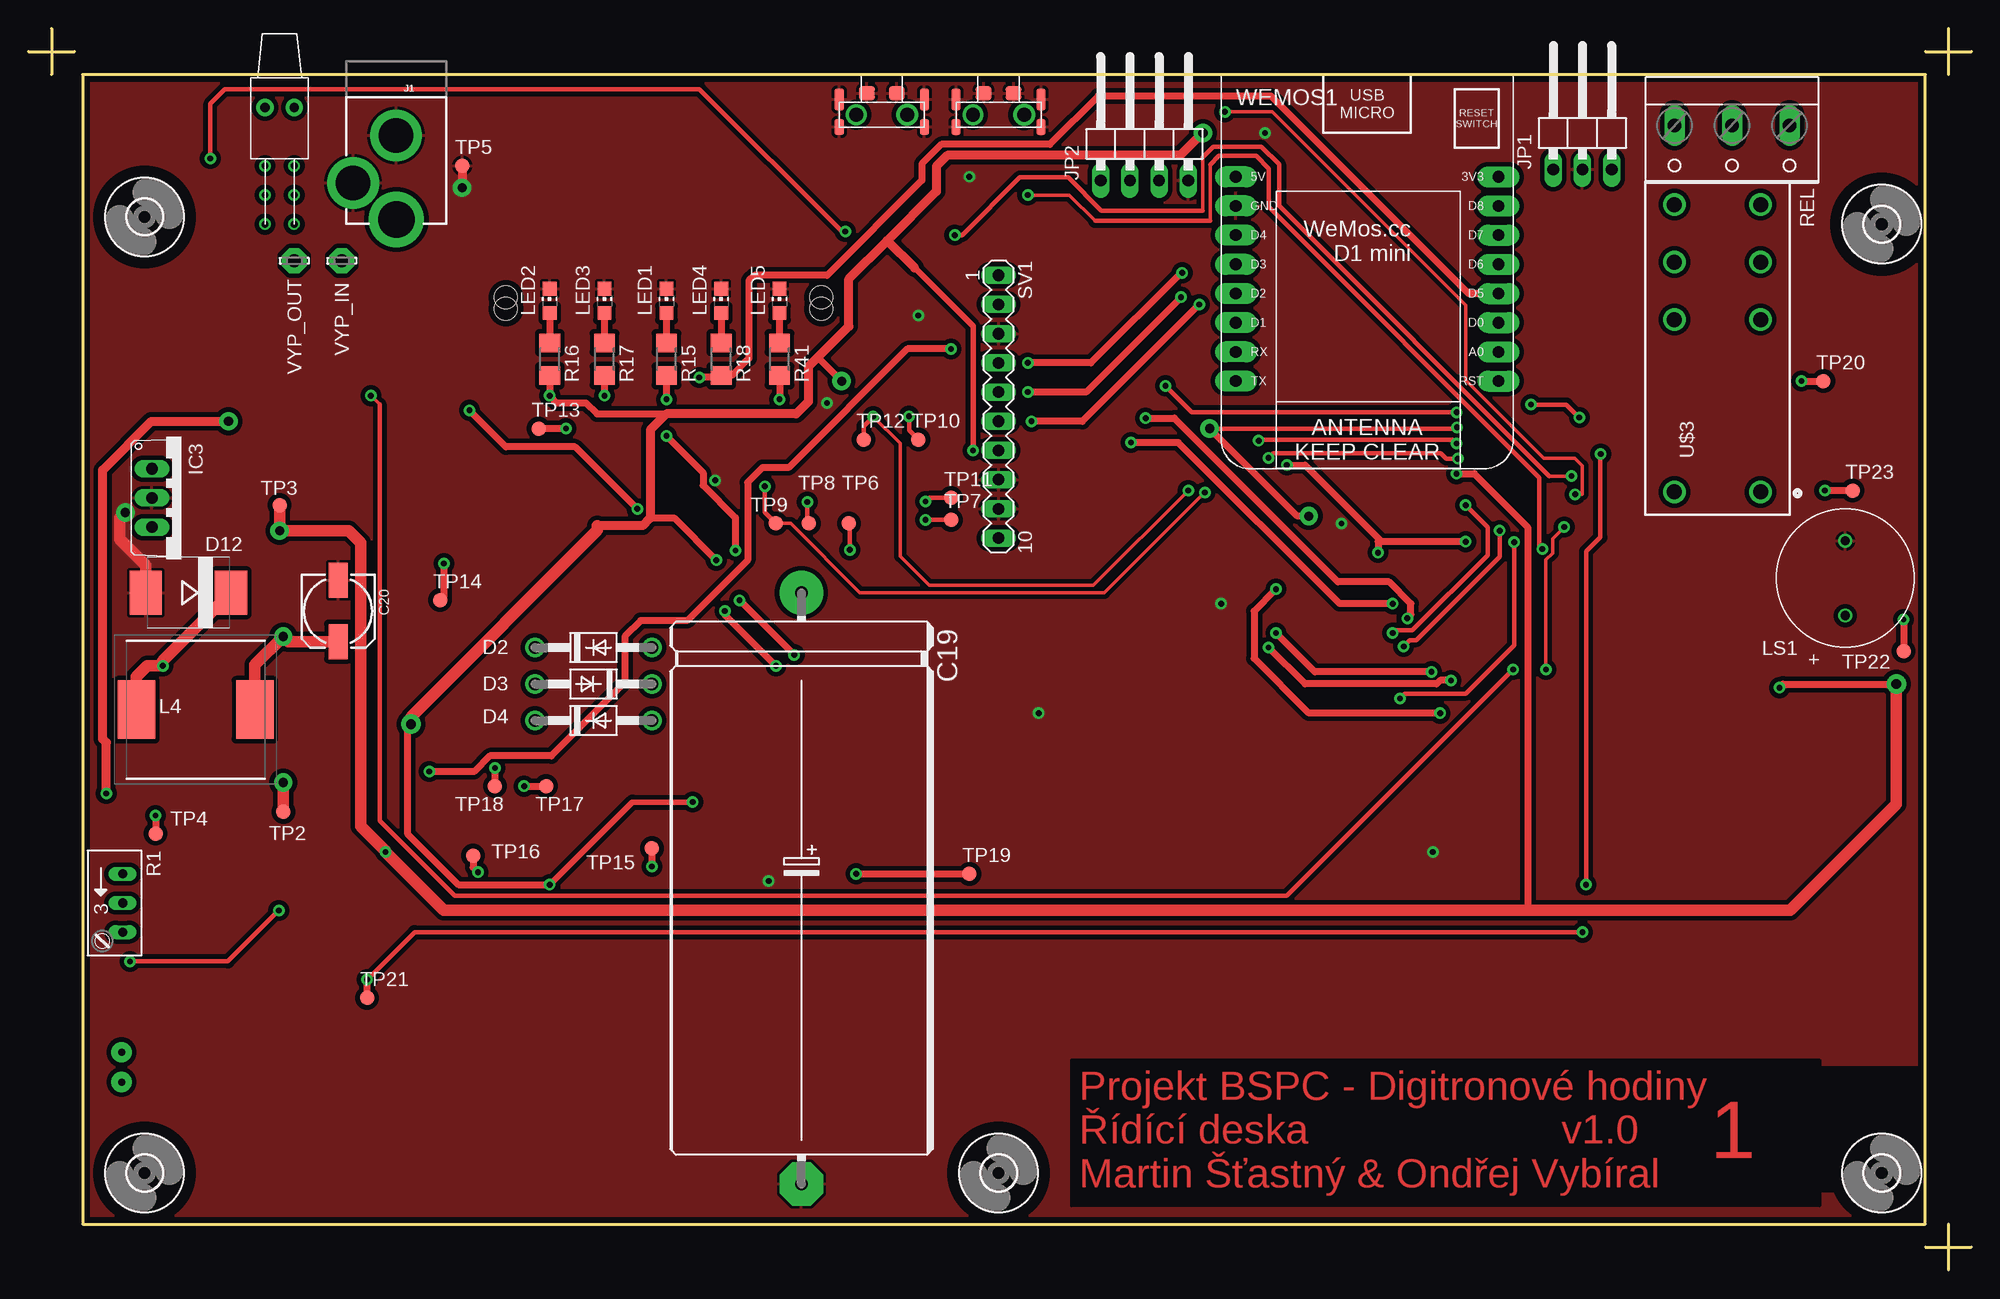
[diagram p4: board, top side]
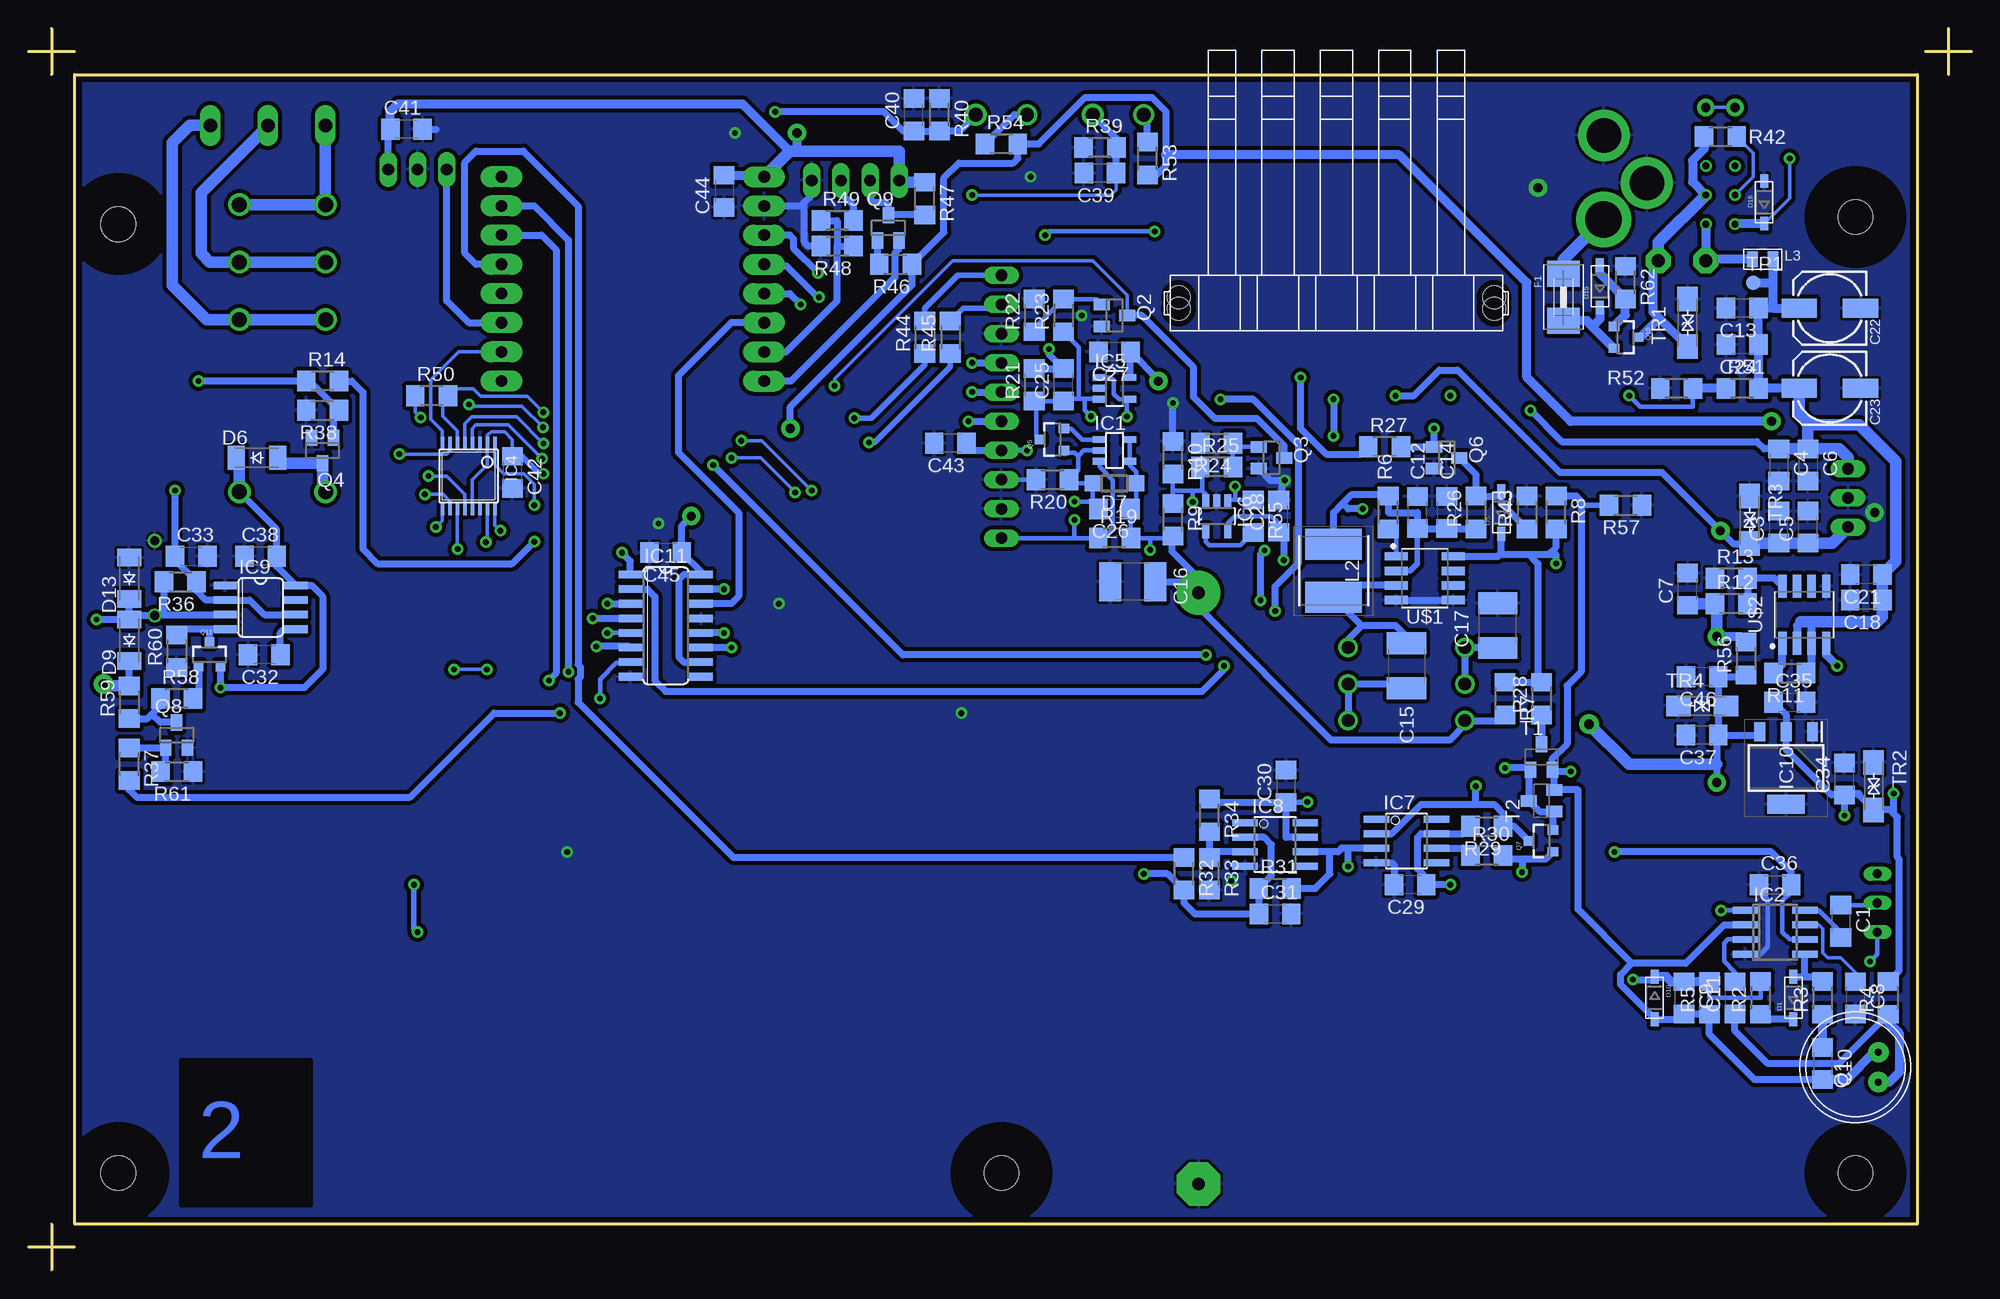
[diagram p5: board, bottom side, seen from below]

Size 169 x 108 mm. Coordinates in mm from the lower left corner, seen from the top.
Outline: 2,108 2,104
Outline: 0,106 4,106
Outline: 167,108 167,104
Outline: 165,106 169,106
Outline: 167,4 167,0
Outline: 165,2 169,2
Outline: 4.68,4 165,4 165,104 4.68,104 4.68,4
Copper layers (1*16): Top 0.035mm / dielectric 1.5mm / Bottom 0.035mm
Design rules "2 vrstvy trida 5 *": minimum track width 0.25mm, minimum drill 0.5mm, track to track 0.25mm, track to pad 0.25mm, pad to pad 0.25mm, via to via 0.25mm, smd to smd 0.25mm, copper to edge 0.5mm, drill to drill 0.4mm, minimum pad ring 0.2mm, minimum via ring 0.2mm, stop-mask expansion 0.07mm, vias tented up to drill 3mm, thermal gap 0.25mm

### Footprints (pad centres in the part's own frame; a part is rotated, then mirrored left to right if it is on the bottom)
C1206 = smd 1.6 x 1.8: 1 -1.4,0; 2 1.4,0
C1812 = smd 1.9 x 3.4: 1 -1.95,0; 2 1.95,0
E51-22 = drill 1.118 pad 3.81: + -25.4,0 | drill 1.118 pad 3.81 octagon: - 26.035,0
ELECTRO-SMD-C-6MM = smd 3.048 x 1.651: + 2.667,0; - -2.667,0
SOD-123 = smd 1.2 x 0.7: A 1.85,0; C -1.85,0
DO41-10 = drill 1.118: A 5.08,0; C -5.08,0
SOD-123_MINI-SMA = smd 1.5 x 2.1: A 1.8,0; C -1.8,0
SOD123 = smd 1.4 x 1.4: A 1.9,0; C -1.9,0
SMC = smd 2.8 x 3.8: A 3.7,0; C -3.7,0
1812 = smd 2.286 x 2.794: 1 -2.046,0; 2 2.046,0
3,0 = hole 3: 0,0
SOT23-5 = smd 0.6 x 1.2: 1 -0.95,-1.306; 2 0,-1.306; 3 0.95,-1.306; 4 0.95,1.306; 5 -0.95,1.306
SO08 = smd 0.6 x 2.2: 1 -1.905,-2.6; 2 -0.635,-2.6; 3 0.635,-2.6; 4 1.905,-2.6; 5 1.905,2.6; 6 0.635,2.6; 7 -0.635,2.6; 8 -1.905,2.6
TO220V = drill 1.016 long: 1 -2.54,-2.54; 2 0,-2.54; 3 2.54,-2.54
TSSOP16 = smd 0.305 x 0.991: 1 -2.275,-2.918; 2 -1.625,-2.918; 3 -0.975,-2.918; 4 -0.325,-2.918; 5 0.325,-2.918; 6 0.975,-2.918; 7 1.625,-2.918; 8 2.275,-2.918; 9 2.275,2.918; 10 1.625,2.918; 11 0.975,2.918; 12 0.325,2.918; 13 -0.325,2.918; 14 -0.975,2.918; 15 -1.625,2.918; 16 -2.275,2.918
SO08' = smd 0.61 x 2.21: 1 -1.905,-2.616; 2 -0.635,-2.616; 3 0.635,-2.616; 4 1.905,-2.616; 5 1.905,2.616; 6 0.635,2.616; 7 -0.635,2.616; 8 -1.905,2.616
SO08'' = smd 0.66 x 2.032: 1 -1.905,-3.073; 2 -0.635,-3.073; 3 0.635,-3.073; 4 1.905,-3.073; 5 1.905,3.073; 6 0.635,3.073; 7 -0.635,3.073; 8 -1.905,3.073
SOT230P700X180-4N = smd 1.65 x 0.95: 1 -3.15,2.3; 2 -3.15,0; 3 -3.15,-2.3 | smd 1.65 x 3.25: 4 3.15,0
SO16 = smd 0.66 x 2.032: 1 -4.445,-3.073; 2 -3.175,-3.073; 3 -1.905,-3.073; 4 -0.635,-3.073; 5 0.635,-3.073; 6 1.905,-3.073; 7 3.175,-3.073; 8 4.445,-3.073; 9 4.445,3.073; 10 3.175,3.073; 11 1.905,3.073; 12 0.635,3.073; 13 -0.635,3.073; 14 -1.905,3.073; 15 -3.175,3.073; 16 -4.445,3.073
POWER_JACK_PTH_LOCK = drill 2.997 pad 4.115: GND 0.025,6.557; GNDBREAK 3.762,10.7 | drill 3.2 pad 4.115: PWR 0,13.878
1X03/90 = drill 1.016 long: 1 -2.54,-3.81; 2 0,-3.81; 3 2.54,-3.81
1X04/90 = drill 1.016 long: 1 -3.81,-3.81; 2 -1.27,-3.81; 3 1.27,-3.81; 4 3.81,-3.81
INDPM6060X450N = smd 2.7 x 4.9: 1 -2.3,0; 2 2.3,0
L0805 = smd 1.016 x 1.397: 1 -0.889,0; 2 0.889,0
INDM120120X1000N = smd 3.25 x 5.1: 1 -5.15,0; 2 5.15,0
CHIP-LED0805 = smd 1.2 x 1.2: A 0,-1.05; C 0,1.05
CUI_CEM-1201(42) = drill 0.8: M 0,-3.25; P 0,3.25
9.7ELECTRET = drill 0.6 pad 1.778: + 1.3,2; - -1.3,2
SOT23 = smd 1 x 1.4: 1 -0.95,-1.1; 2 0.95,-1.1; 3 0,1.1
SOT23-3 = smd 0.8 x 0.9: 1 -0.95,-1; 2 0.95,-1; 3 0,1.1
RJ9W = drill 0.813 long: A 2.54,0.635; E -2.54,0.635; S 0,0.635
R1206 = smd 1.6 x 1.803: 1 -1.422,0; 2 1.422,0
W237-103 = drill 1.194 long: 1 -5,-1.29; 2 0,-1.29; 3 5,-1.29
MA10-1 = drill 1.016 long: 1 -11.43,0; 2 -8.89,0; 3 -6.35,0; 4 -3.81,0; 5 -1.27,0; 6 1.27,0; 7 3.81,0; 8 6.35,0; 9 8.89,0; 10 11.43,0
SOT23-BEC = smd 1 x 1.4: B -0.95,-1.1; C 0,1.1; E 0.95,-1.1
B1,27 = smd 1.27 x 1.27: TP 0,0
DO214AC+MINIMELF_BIDIR = smd 2.123 x 1.8: P$1 -2.064,0; P$2 2.064,0
SOIC127P599X175-8 = smd 2.021 x 0.726: 1 -2.482,1.905; 2 -2.482,0.635; 3 -2.482,-0.635; 4 -2.482,-1.905; 5 2.482,-1.905; 6 2.482,-0.635; 7 2.482,0.635; 8 2.482,1.905
41.52 = drill 1.3 pad 1.9: 1 -12.5,-3.75; 2 2.5,-3.75; 3 7.5,-3.75; 4 12.5,-3.75; 5 12.5,3.75; 6 7.5,3.75; 7 2.5,3.75; 8 -12.5,3.75
GW22LCV = drill 0.6: 1 1.27,5.08; 2 1.27,2.54; 3 1.27,0; 4 -1.27,5.08; 5 -1.27,2.54; 6 -1.27,0 | drill 0.8 pad 1.5: 7 1.27,-5.08; 8 -1.27,-5.08
KSC421V = drill 1.2 pad 1.93: P$1 -2.225,0 | drill 1.2 pad 1.8: P$2 2.225,0 | smd 0.8 x 1.4: P$3 3.7,1.05; P$4 -3.7,1.05 | smd 0.8 x 1.95: P$5 3.7,-1.325; P$6 -3.7,-1.325 | smd 1.4 x 1.25: P$7 1.3,-1.875; P$8 -1.3,-1.875
LC_5LED = hole 2: -13.725,0.5; -13.725,-0.5; 13.725,0.5; 13.725,-0.5
LSP11 = drill 1.118 pad 2.159 octagon: MP 0,0
WEMOS-D1-MINI = drill 1.016 pad 1.829 long: 3V3 -10.16,-10.16; 5V 12.7,-10.16; A0 -10.16,5.08; D0 -10.16,2.54; D1 12.7,2.54; D2 12.7,0; D3 12.7,-2.54; D4 12.7,-5.08; D5 -10.16,0; D6 -10.16,-2.54; D7 -10.16,-5.08; D8 -10.16,-7.62; GND 12.7,-7.62; RESET -10.16,7.62; RX 12.7,5.08; TX 12.7,7.62

### Placement (x,y rotation side)
C1  11.35,30.35 270 bottom
C3  16.75,64.64 90 bottom
C4  16.75,70.04 270 bottom
C5  14.21,64.64 90 bottom
C6  14.21,70.04 270 bottom
C7  24.68,59.24 90 bottom
C8  10.08,23.68 270 bottom
C9  25,23.68 270 bottom
C10  12.94,17.97 270 bottom
C11  20.56,23.68 90 bottom
C12  48.18,65.91 90 bottom
C13  19.92,83.69 180 bottom
C14  45.64,65.91 90 bottom
C15  49.13,52.58 270 bottom
C16  72.94,59.88 180 bottom
C17  41.2,56.07 90 bottom
C18  9.13,58.29 180 bottom
C19  67.23,33.53 270 top
C20  26.91,57.34 270 top
C21  9.13,60.52 180 bottom
C22  12.3,83.69 180 bottom
C23  12.3,76.71 180 bottom
C24  19.92,80.52 180 bottom
C25  78.98,77.03 90 bottom
C26  74.53,66.23 180 bottom
C27  74.53,79.88 180 bottom
C28  60.24,65.59 90 bottom
C29  48.81,33.53 180 bottom
C30  59.61,42.1 90 bottom
C31  60.56,30.99 0 bottom
C32  148.51,53.53 180 bottom
C33  154.86,62.1 0 bottom
C34  11.03,42.73 90 bottom
C35  15.79,49.4 0 bottom
C36  17.06,33.53 0 bottom
C37  23.41,46.55 180 bottom
C38  148.83,62.1 180 bottom
C39  75.8,95.44 180 bottom
C40  92,100.52 90 bottom
C41  136.13,99.25 180 bottom
C42  126.92,69.41 270 bottom
C43  88.82,71.94 180 bottom
C44  108.5,93.85 270 bottom
C45  113.58,62.42 180 bottom
C46  23.41,51.62 180 bottom
D1  15.48,23.68 90 bottom
D2  49.13,54.16 0 top
D3  49.13,47.81 0 top
D4  49.13,50.99 180 top
D5  40.88,65.91 90 bottom
D6  149.15,70.67 0 bottom
D7  74.53,68.45 180 bottom
D9  160.26,54.8 90 bottom
D10  27.54,23.68 270 bottom
D12  13.89,58.93 180 top
D13  160.26,60.2 90 bottom
D15  32.3,85.6 90 bottom
D16  18.02,92.9 90 bottom
F1  35.48,84.64 270 bottom
H1  10.08,8.45 0 top
H2  10.08,91.63 0 top
H4  84.38,8.45 0 top
H5  161.21,8.45 0 top
H6  161.21,91 0 top
IC1  74.53,71.31 270 bottom
IC2  17.06,29.4 270 bottom
IC3  13.26,67.18 270 top
IC4  130.73,69.09 180 bottom
IC5  74.53,76.71 270 bottom
IC6  65.64,65.59 180 bottom
IC7  OPA340U  [SO08']  49.13,37.34 270 bottom
IC8  OPA340U  [SO08']  60.56,37.02 270 bottom
IC9  NE555D  [SO08'']  148.83,57.66 270 bottom
IC10  16.11,43.69 270 bottom
IC11  113.58,56.07 270 bottom
J1  31.99,105.28 180 top
JP1  135.18,99.57 0 top
JP2  97.08,98.61 0 top
L2  55.48,60.83 270 bottom
L3  18.14,87.95 0 bottom
L4  14.53,48.77 0 top
LED1  55.48,84.33 0 top
LED2  45.32,84.33 0 top
LED3  50.09,84.33 0 top
LED4  60.24,84.33 0 top
LED5  65.33,84.33 0 top
LS1  158.03,60.2 180 top
Q1  10.08,17.65 270 bottom
Q2  74.53,83.06 270 bottom
Q3  60.88,70.67 270 bottom
Q4  143.43,71.31 180 bottom
Q5  79.93,72.26 90 bottom
Q6  45.64,70.67 270 bottom
Q7  37.38,37.34 90 bottom
Q8  156.13,46.55 0 bottom
Q9  94.22,90.68 0 bottom
Q10  30.08,81.15 270 bottom
Q11  153.27,53.53 0 bottom
R1  7.54,31.94 270 top
R2  18.34,23.68 90 bottom
R3  12.94,23.68 90 bottom
R4  7.22,23.68 90 bottom
R5  22.78,23.68 90 bottom
R6  50.72,65.91 270 bottom
R7  40.56,49.72 270 bottom
R8  36.11,65.91 270 bottom
R9  69.45,65.28 270 bottom
R10  69.45,70.67 270 bottom
R11  15.79,51.94 180 bottom
R12  20.88,57.98 0 bottom
R13  20.88,60.2 0 bottom
R14  143.43,77.34 0 bottom
R15  55.48,79.25 270 top
R16  45.32,79.25 270 top
R17  50.09,79.25 270 top
R18  60.24,79.25 270 top
R19  74.53,63.69 0 bottom
R20  79.93,68.77 180 bottom
R21  81.52,77.03 90 bottom
R22  81.52,83.06 90 bottom
R23  78.98,83.06 90 bottom
R24  65.64,71.94 180 bottom
R25  65.66,69.87 0 bottom
R26  43.1,65.91 90 bottom
R27  51.04,71.63 0 bottom
R28  37.38,49.72 90 bottom
R29  42.15,38.61 180 bottom
R30  42.15,36.07 0 bottom
R31  60.56,33.21 0 bottom
R32  68.5,34.48 270 bottom
R33  66.28,34.48 270 bottom
R34  66.28,39.56 270 bottom
R36  155.81,59.88 180 bottom
R37  160.26,44.01 270 bottom
R38  143.43,74.8 180 bottom
R39  75.8,97.66 0 bottom
R40  89.77,100.52 270 bottom
R41  65.33,79.25 270 top
R42  21.83,98.61 180 bottom
R43  38.66,65.91 90 bottom
R44  91.04,81.15 90 bottom
R45  88.82,81.15 90 bottom
R46  93.58,87.5 180 bottom
R47  91.04,93.22 270 bottom
R48  98.66,89.09 180 bottom
R49  98.66,91.31 0 bottom
R50  133.95,76.07 0 bottom
R51  19.92,76.71 0 bottom
R52  25.64,76.71 0 bottom
R53  71.67,96.71 270 bottom
R54  84.38,97.98 0 bottom
R55  62.47,65.59 270 bottom
R56  19.61,53.21 90 bottom
R57  30.08,66.55 180 bottom
R58  156.13,49.72 0 bottom
R59  160.26,49.4 90 bottom
R60  156.13,53.85 90 bottom
R61  156.13,43.37 180 bottom
R62  30.08,85.92 270 bottom
REL  148.19,98.3 180 top
SV1  84.38,75.12 270 top
T1  37.38,44.64 0 bottom
T2  37.38,40.83 90 bottom
TP1  18.97,85.92 0 bottom
TP2  22.14,39.88 0 top
TP3  21.83,66.55 180 top
TP4  11.03,37.97 0 top
TP5  37.7,96.08 0 top
TP6  71.36,64.96 0 top
TP7  80.25,65.28 0 top
TP8  67.87,64.96 0 top
TP9  65.01,64.96 0 top
TP10  77.39,72.26 0 top
TP11  80.25,67.18 0 top
TP12  72.63,72.26 0 top
TP13  44.37,73.22 0 top
TP14  35.8,58.29 0 top
TP15  54.21,36.7 0 top
TP16  38.66,36.07 0 top
TP17  45.01,42.1 0 top
TP18  40.56,42.1 0 top
TP19  81.83,34.48 0 top
TP20  156.13,77.34 0 top
TP21  29.45,23.68 0 top
TP22  163.12,53.85 0 top
TP23  158.67,67.82 0 top
TR1  24.68,82.42 270 bottom
TR2  8.49,42.1 270 bottom
TR3  19.29,65.28 270 bottom
TR4  23.41,49.09 0 bottom
U$1  47.55,60.2 0 bottom
U$2  14.53,57.02 90 bottom
U$3  146.92,80.2 90 top
U$4  21.83,96.08 180 top
U$5  74.22,100.52 180 top
U$6  84.38,100.52 180 top
U$7  55.23,84.14 180 top
VYP_IN  27.23,87.82 0 top
VYP_OUT  23.1,87.82 0 top
WEMOS1  117.71,84.96 180 top

### Tracks (layer width: path | path; a pad name or v marks a point on that pad's centre or on a via)
+3V3  (via drill 0.5, 0.5 pad 1, 0.8 pad 1.5)
  Top 0.406: v134.91,74.17 133.77,75.3 v130.69,75.3 | v124.25,73.32 124.14,73.22 v102.74,73.22
  Top 0.6: v11.03,39.56 TP4.TP | v111.36,65.59 110.36,65.59 v102.74,73.22
  Top 0.8: v6.75,41.47 6.75,45.89 6.42,46.22 6.42,69.59 10.68,73.85 v17.38,73.85
  Bottom 0.3: R50.1 135.38,74.64 v134.91,74.17 | v130.69,75.3 130.55,75.17 126.09,75.17 v124.25,73.32
  Bottom 0.6: C35.1 16.11,48.32 IC10.2 16.11,45.27 12.17,41.34 C34.1 | R4.2 6.27,26.06 6.27,35.75 6.43,35.91 6.43,39.4 6.75,39.72 | 6.75,39.72 7.06,40.04 TR2.P$2 9.76,41.31 9.76,41.47 10.9,41.47 C34.1 | C34.1 v11.03,39.56 | v102.74,73.22 102.74,75.13 92.17,85.7 R46.1 89.37,90.29 89.37,95.03 88.09,96.31 83.35,96.31 82.95,96.71 R54.2 81.12,97.98 77.07,102.03 71.28,102.03 70.09,100.84 70.09,97.03 70.09,96.08 70.87,95.29 R53.2 | v111.36,65.59 112.19,64.77 C45.1 110.51,60.75 IC11.16 112,60.52 112.43,60.08 112.43,53.33 112,52.9 IC11.10 | 6.75,39.72 v6.75,41.47
  Bottom 0.8: v17.38,73.85 34.84,73.85 38.66,77.66 38.66,85.92 49.77,97.03 70.09,97.03
+5V  (via drill 0.5, 0.5 pad 1, 0.8 pad 1.5, 0.85 pad 1.5)
  Top 0.5: v82.15,71.31 82.15,82.11 77.06,87.19 | v45.32,33.53 52.51,40.72 v57.76,40.72
  Top 0.6: R16.2 v45.32,76.07 45.96,75.44 48.5,75.44 49.45,74.48 55.48,74.48 | v70.72,77.34 68.81,79.26 68.81,79.58 | 54.09,65.44 56.14,65.44 v59.82,61.76 | v33.26,47.5 32.94,47.18 32.94,37.97 37.38,33.53 v45.32,33.53
  Top 0.8: v102.16,98.93 100.2,96.98 79.92,96.98 78.96,96.02 78.96,93.85 74.68,89.58 | 49.47,64.76 53.42,64.76 54.09,65.44 54.09,73.09 55.48,74.48 66.75,74.48 67.83,75.56 67.83,78.6 68.81,79.58 71.35,82.11 71.35,86.24 74.68,89.58 | 77.06,87.19 74.68,89.58
  Top 1: v22.14,42.42 TP2.TP | 49.47,64.76 49.47,64.35 33.26,48.13 v33.26,47.5
  Bottom 0.4: C28.1 60.24,64.96 60.88,65.59 64.06,65.59 64.69,64.96 IC6.5
  Bottom 0.5: SV1.7 v82.15,71.31 | v57.76,40.72 59.59,40.72 C30.1
  Bottom 0.6: JP1.3 137.72,99.25 C41.2 | R29.2 44.2,37.97 IC7.7 47.85,37.97 48.17,37.66 48.17,34.9 47.41,34.14 C29.1 v45.32,33.53 | IC8.7 59.61,37.66 C30.1 66,40.7 R34.1 | C37.1 22.14,46.41 22.14,44.01 v22.14,42.42 | C37.1 22.02,48.42 TR4.P$2 22.02,49.75 C46.1 19.77,51.62 R56.1 | C37.1 18.7,46.55 IC10.3 | IC5.5 73.23,79.79 C27.1 70.72,77.47 v70.72,77.34 | C43.1 86.78,71.31 SV1.7 | C28.1 59.82,63.77 v59.82,61.76
  Bottom 0.8: C41.2 137.53,100.84 136.89,101.47 106.92,101.47 102.79,97.34 | C44.1 105.14,95.25 WEMOS1.5V | 102.16,97.34 v102.16,98.93
  Bottom 1: WEMOS1.5V 102.79,97.34 102.16,97.34 93.27,97.34 JP2.1 93.1,94.64 R47.1 | v33.26,47.5 29.77,44.01 22.14,44.01
+12V  (via drill 0.5 pad 1, 0.8 pad 1.5, 0.85 pad 1.5)
  Top 0.6: R17.2 v50.09,76.07 | v152.32,50.67 152.64,50.99 v162.48,50.99 | v124.2,69.28 125.77,69.28 130.41,64.64 130.41,31.3
  Top 1: TP3.TP v21.83,64.33 27.86,64.33 28.9,63.28 28.9,38.62 31.04,36.49 v31.04,36.38 36.11,31.3 130.41,31.3 153.27,31.3 162.48,40.51 v162.48,50.99
  Bottom 0.3: IC4.13 130.41,68.78 129.11,70.08 IC4.2 | IC4.2 | IC4.2 129.11,72.62 128.78,72.95 127.61,72.95 126.92,72.26 C42.1
  Bottom 0.4: IC2.6 15.79,28.77 16.43,29.4 16.43,32.13 15.66,32.89 C36.2
  Bottom 0.5: C42.1 126.7,70.58 126.28,70.99 124.58,69.28 v124.2,69.28
  Bottom 0.6: R59.2 D9.C | TR3.P$2 20.72,63.21 v21.83,64.33 26.91,69.41 35.8,69.41 44.69,78.3 46.27,78.3 48.5,76.07 v50.09,76.07 | Q11.2 v152.32,50.67 | v152.32,50.67 | v152.32,50.67 145.01,50.67 143.43,52.26 143.43,58.61 144.38,59.56 IC9.8 147.43,61.24 C38.1 147.43,64.45 U$3.1 | C36.2 15.66,34.67 17.38,36.38 v31.04,36.38
  Bottom 1: IC3.3 12.12,63.24 C5.1 C3.1 19.26,63.24 TR3.P$2 | U$3.1 150.67,70.4 D6.C | v162.48,50.99 162.31,50.83 R59.2
AGND  (via drill 0.5 pad 1)
  Top 0.6: v34.84,43.37 38.76,43.37 40.12,44.74 45.48,44.74 51.87,51.13 51.87,55.13 53.24,56.5 57.29,56.5 62.55,61.77 62.55,68.54 63.84,69.82 66.11,69.82 76.44,80.14 v80.25,80.14
  Bottom 0.5: R57.2 33.89,66.55
  Bottom 0.6: R21.2 81.5,78.42 C25.2 80.25,79.69 v80.25,80.14 | C10.2 18.84,16.57 22.78,20.51 R5.1 22.8,22.29 C9.2 25.45,21.84 D10.A 27.54,21.88 30.5,24.84 30.5,25.71 29.52,26.68 | 29.52,26.68 24.86,26.68 21.51,30.04 IC2.2 | 29.52,26.68 34.21,31.38 34.21,41.78 T2.E 36.28,43.37 | 36.28,43.37 36.28,43.39 T1.E 36.44,44.49 35.16,45.76 35.16,50.84 33.89,52.12 33.89,66.55 33.89,66.87 34.36,67.33 R8.1 | v34.84,43.37 36.28,43.37
  Bottom 0.8: Q1.- 8.46,18.95 10.84,16.57 C10.2
BTN_1  (via drill 0.5 pad 1)
  Top 0.3: 131.43,62.99 v131.68,62.74 | v86.92,93.53 90.54,93.53 92.78,91.29 | 102.78,91.29 102.78,96.18
  Top 0.406: 102.78,96.18 103.53,96.93 106.78,96.93 107.88,95.83 107.88,92.5 131.43,68.95 131.43,62.99 | 92.78,91.29 102.78,91.29
  Bottom 0.3: C39.1 74.4,93.98 74.85,93.53 v86.92,93.53 | IC4.11 131.71,62.76 v131.68,62.74
  Bottom 0.6: U$5.P$1 74.38,98.46 R39.2 74.38,95.46 C39.1
BTN_2  (via drill 0.5 pad 1)
  Top 0.3: v134.54,67.5 135.18,67.5 135.18,69.97 134.52,70.63 131.81,70.63 125.01,77.43 125.01,83.95 108.19,100.77 v104.06,100.77
  Bottom 0.3: IC4.10 132.36,66.9 132.95,67.5 v134.54,67.5
  Bottom 0.6: U$6.P$1 88.02,99.1 R40.2 91.97,99.1 C40.1 92.95,99.12 94.6,100.77 v104.06,100.77
BUZZER_ON  (via drill 0.5 pad 1)
  Top 0.6: v122.79,48.45 111.36,48.45 106.6,53.21 106.6,57.34 v108.5,59.24
  Bottom 0.6: R37.2 160.26,41.78 159.62,41.15 135.81,41.15 128.51,48.45 v122.79,48.45 | v108.5,59.24 IC11.15
EXT_MCU
  Bottom 0.6: WEMOS1.D0 130.73,82.42 132.63,84.33 JP1.1
GND  (via drill 0.5, 0.5 pad 1, 0.8 pad 1.5)
  Top 0.8: TP5.TP v37.7,94.17
  Top 1: D12.A 10.19,61.31 7.94,63.57 7.94,65.44 v8.4,65.91
  Bottom 0.254: R40.1 89.61,102.11
  Bottom 0.4: IC2.4 18.34,27.5 17.7,28.13 17.7,32.26 18.46,33.02 C36.1 | SV1.8 R20.2
  Bottom 0.6: C41.1 133.59,99.25 | WEMOS1.GND 101.84,92.58 101.52,92.9 | 101.52,92.9 100.89,93.53 JP2.4 | R48.2 101.2,89.09 101.52,89.41 101.52,92.9 | U$1.4 U$1.5 | IC7.4 50.4,35.43 50.22,35.25 C29.2 | Q3.2 60.97,68.71 59.93,68.71 | 59.93,68.71 v59.72,68.71 | C28.2 59.93,67.31 59.93,68.71 | R10.1 v69.45,75.44
  other vias: 87.87,48.45 114.22,64.96 107.55,98.93 122.16,36.38 81.83,95.12 103.74,57.98 64.37,33.84 77.39,83.06
  pour Bottom (isolate 0.35): 165.02,104.01 4.68,104.01 4.68,4 165.02,4
  pour Top (isolate 0.4): 165.02,104.01 4.68,104.01 4.68,4 165.02,4
  cutout Top: 90.72,18.29 155.81,18.29 155.81,5.59 90.72,5.59
  cutout Bottom: 144.38,18.29 155.81,18.29 155.81,5.59 144.38,5.59
LED_B
  Bottom 0.5: R45.2 87.7,83.69 84.06,83.69 SV1.2
LED_BR  (via drill 0.5 pad 1)
  Top 0.6: v119.94,56.7 120.25,57.02 120.25,57.98 118.35,59.88 113.9,59.88 99.66,74.12 v97.17,74.12
  Bottom 0.5: v97.17,74.12 95.7,74.12 91.04,78.78 R44.1
  Bottom 0.6: v119.94,56.7 IC11.4
LED_T
  Bottom 0.5: SV1.1 88.19,86.55 91.04,83.69 R44.2
LED_TR  (via drill 0.5 pad 1)
  Top 0.6: v118.67,57.98 114.06,57.98 100.03,72 v95.9,72
  Bottom 0.5: v95.9,72 95.43,72 88.82,78.61 R45.1
  Bottom 0.6: v118.67,57.98 IC11.3
MUL_A0  (via drill 0.5 pad 1)
  Top 0.4: v118.67,55.44 118.89,55.66 120.37,55.66 126.92,62.2 126.92,64.64 v125.02,66.55
  Bottom 0.3: v125.02,66.55 125.02,68.37 125.93,69.29 127.67,69.29 128.45,70.07 IC4.1
  Bottom 0.4: IC11.5 v118.67,55.44
MUL_A1  (via drill 0.5 pad 1)
  Top 0.4: v119.62,54.26 120.16,54.8 120.72,54.8 127.97,62.05 v127.97,64.33
  Bottom 0.3: IC4.16 128.45,64.81 v127.97,64.33
  Bottom 0.6: IC11.6 116.76,54.26 v119.62,54.26
MUL_A2  (via drill 0.5 pad 1)
  Top 0.4: v119.3,49.72 119.73,50.15 125.03,50.15 129.23,54.35 v129.23,63.33
  Bottom 0.3: IC4.15 129.11,63.45 v129.23,63.33
  Bottom 0.4: IC11.7 117.29,52.9 117.37,52.82 117.9,52.82 119.3,51.42 v119.3,49.72
MULADC
  Bottom 0.3: IC4.8 133,73 134,74 134,77.46 131.59,79.88 WEMOS1.A0
N$1
  Bottom 0.6: D1.C 17.7,21.84 18.13,22.26 R2.1
N$2  (via drill 0.5 pad 1)
  Top 0.6: TP23.TP v156.26,67.82
  Bottom 0.6: IC9.6 148.51,57.02 149.78,58.29 IC9.2 153.59,58.29 154.39,59.09 R36.1 156.26,61.75 C33.1 v156.26,67.82
N$3  (via drill 0.5)
  Top 1: L4.1 9.38,51.62 10.33,52.58 v11.67,52.58 11.67,53.01 D12.C
  Bottom 0.7: U$2.4 12.62,53.53 v11.67,52.58
N$4
  Bottom 0.6: R53.1 71.67,100.2 U$5.P$2
N$5
  Bottom 0.6: R54.1 83.26,100.52 U$6.P$2
N$6
  Bottom 0.4: R55.2 63.59,63.05 66.28,63.05 66.59,63.37 IC6.4
N$7
  Bottom 1: D6.A 146.88,70.21 Q4.3 143.43,67.96 U$3.8
N$8
  Bottom 1: REL.1 154.98,99.59 156.5,98.06 156.5,85.67 153.53,82.7 U$3.2 U$3.7
N$9
  Bottom 1: U$3.6 U$3.3 153.25,87.7 154,88.45 154,93.71 148.19,99.53 REL.2
N$10
  Bottom 0.3: IC2.7 13.26,30.04 12.94,29.72 12.94,27.62 12.49,27.18 11.35,27.18 10.08,25.91 C8.1
N$11
  Bottom 0.8: C10.1 R3.1
N$12
  Bottom 0.6: R4.1 11.52,17.97 17.7,17.97 20.56,20.83 C11.1 | Q1.+ 7.13,16.35
  Bottom 0.8: R4.1 7.22,21.54 6.22,20.54 6.22,17.26 7.13,16.35
N$13
  Bottom 0.4: IC2.8 13.26,31.3 11.35,29.4 C1.2
N$14
  Bottom 1: J1.PWR 35.48,87.91 F1.1
N$15
  Bottom 0.8: U$4.4 VYP_OUT.MP 22.97,87.95 L3.1
N$16  (via drill 0.5 pad 0.8)
  Top 0.4: v21.76,31.3 17.32,26.86 v8.81,26.86
  Bottom 0.4: v21.76,31.3 19.67,31.3 IC2.1 | v8.81,26.86 8.18,27.5 R1.A
N$17
  Bottom 0.4: C1.1 8.36,31.75 R1.S
N$18
  Bottom 0.4: C11.2 20.56,25.91 21.51,26.86 21.51,28.45 21.19,28.77 IC2.3
N$19
  Top 0.6: LED2.A R16.1
N$20
  Bottom 0.6: R3.2 13.37,25.54 14.53,25.54 | D1.A 14.53,25.54 | 14.53,25.54 14.46,25.59 IC2.5
N$22
  Bottom 0.4: R6.2 50.03,63.8 U$1.1
N$23
  Bottom 0.6: U$1.3 54.45,59.56 L2.2 53.02,56.07 | 53.02,56.07 50.09,56.07 49.13,55.12 C15.1 | 53.02,56.07 54.21,54.88 D2.A
N$24
  Bottom 0.6: C15.2 49.49,50.99 D4.C D3.A
N$25
  Bottom 0.6: D4.A D2.C 41.24,54.16 C17.1
N$27
  Bottom 0.4: R22.1 81.52,81.94 R23.2 76.11,84.48 Q2.1
N$28
  Bottom 0.7: R11.2 16.43,52.73 U$2.1
N$29
  Bottom 0.4: R25.2 64.23,71.63 64.22,71.63 | 64.22,71.63 R24.1 | Q3.1 64.22,71.63
N$30
  Bottom 1: U$3.4 U$3.5 143.19,92.72 REL.3
N$31
  Bottom 0.6: U$2.8 17.12,60.2 R13.2 R12.2
N$32
  Top 0.6: LED3.A R17.1
N$33  (via drill 0.5 pad 1)
  Top 0.6: v154.22,77.34 TP20.TP
  Bottom 0.6: Q4.1 142.48,74.33 R38.1 144.55,77.34 R14.1 v154.22,77.34
N$34
  Top 0.6: LED1.A R15.1
N$35
  Bottom 0.8: R42.2 23.25,97.55 24.25,96.55 24.25,94.69 U$4.5 | TR1.P$2 27.15,82.82 | 27.15,82.82 27.7,83.38 27.7,87.34 VYP_IN.MP | Q10.3 28.81,81.15 27.15,82.82
  Bottom 1: U$4.5 27.23,89.41 VYP_IN.MP
N$38  (via drill 0.8 pad 1.5)
  Top 1: L4.2 19.68,52.65 v22.14,55.12 22.59,54.67 C20.+
  Bottom 0.8: R56.2 20.09,55.12 v22.14,55.12
  Bottom 1: v22.14,55.12 22.14,57.82 R12.1 24.55,57.98 C7.1
N$39
  Bottom 0.6: IC9.4 153.27,55.75 | 153.27,55.75 155.65,55.75 R60.2 | Q11.3 153.27,55.75
N$40
  Top 0.6: LED4.A R18.1
N$41  (via drill 0.5 pad 1)
  Top 0.6: v46.74,73.22 TP13.TP
  Bottom 0.6: R27.2 Q6.1 v46.74,73.22
N$42  (via drill 0.5 pad 1)
  Top 0.4: v78.03,66.87 78.34,67.18 TP11.TP
  Bottom 0.4: 77.71,70.83 77.71,69.57 R20.1 78.19,68.45 D7.A 76.43,66.73 C26.2 76.57,66.87 v78.03,66.87 | 78.93,71.11 78,71.11 77.71,70.83 | 78.93,71.11 78.93,70.99 78.93,71 78.93,71.11 | 78.93,71.11 Q5.1 | 77.71,70.83 77.22,71.31 IC1.2
N$43
  Bottom 0.4: Q5.2 78.3,73.21 77.34,72.26 IC1.1
N$44
  Bottom 0.6: C32.1 147.11,55.44 146.79,55.75 IC9.5
N$45  (via drill 0.5)
  Top 0.6: v71.99,34.48 TP19.TP
  Bottom 0.6: 61.98,31.01 R31.1 60.88,34.31 60.88,37.02 61.52,37.66 IC8.2 | 61.98,31.01 C31.1 | 61.98,31.01 62.01,30.99 67.55,30.99 68.5,31.94 R32.2 69.92,34.48 v71.99,34.48
N$46
  Bottom 0.6: R28.1 T1.C
N$47  (via drill 0.5 pad 1)
  Top 0.6: v40.56,43.69 TP18.TP
  Bottom 0.6: Q7.2 36.39,39.78 T2.B 37.53,39.88 T2.C 38.48,43.39 T1.B 38.48,43.69 v40.56,43.69
N$48  (via drill 0.5)
  Top 0.6: TP15.TP v54.21,35.11
  Bottom 0.6: 55.8,36.38 55.09,36.38 54.77,36.7 TP15.TP | 55.8,36.38 IC8.6 | IC7.3 TP15.TP | R31.2 57.07,33.21 55.8,34.48 55.8,36.38 | v54.21,35.11 TP15.TP
N$49
  Bottom 0.6: IC8.3 65.79,36.38 R33.1 R34.2
N$50  (via drill 0.5)
  Top 0.6: TP16.TP 38.66,35.04 v39.08,34.62
  Bottom 0.6: Q7.1 37.02,35.75 39.08,35.75 | 39.08,35.75 40.41,35.75 R30.2 | 39.08,35.75 v39.08,34.62
N$51
  Bottom 0.6: R30.1 44.2,36.7 IC7.6
N$52  (via drill 0.5)
  Top 0.6: v43.1,42.1 TP17.TP
  Bottom 0.6: Q7.3 39.76,38.61 R29.1 40.73,39.73 41.51,40.51 43.1,40.51 | IC7.2 50.4,37.97 47.86,40.51 43.1,40.51 | 43.1,40.51 v43.1,42.1
N$53
  Bottom 0.6: R58.2 154.22,50.21 Q11.1
N$54  (via drill 0.5 pad 1)
  Top 0.6: v163.12,56.6 TP22.TP
  Bottom 0.6: D9.A 159.91,56.95 LS1.P 157.97,57.02 157.4,57.02 | D9.A D13.C | IC9.3 157.4,57.02 | D9.A v163.12,56.6 | R36.2 157.23,57.18 157.4,57.02
N$55
  Bottom 0.6: R59.1 158.67,47.98 158.28,48.37 | 158.28,48.37 157.55,49.1 R58.1 | 158.28,48.37 157.55,47.65 Q8.3
N$56
  Top 0.6: R41.1 LED5.A
N$57
  Bottom 0.6: R37.1 157.1,45.43 | 157.1,45.43 Q8.1 | R61.2 157.1,43.82 157.1,45.43
N$58
  Bottom 0.8: Q10.2 32.96,82.08 | 32.96,82.08 33.26,82.38 33.26,82.42 33.43,82.6 F1.2 | D15.C 32.3,82.74 32.96,82.08
N$59
  Bottom 0.6: R43.1 40.88,66.71 D5.A 41.31,67.33 R26.2 43.1,69.23 Q6.3
N$60
  Bottom 0.6: Q9.1 95.17,87.67 R46.2
N$61
  Bottom 0.3: R42.1 18.97,97.18 18.97,95.12 U$4.2
N$63
  Bottom 0.8: Q10.1 30.08,83.1 R62.2 32.3,86.72 D15.A
NOISE_AD  (via drill 0.5, 0.5 pad 1)
  Top 0.4: v135.49,33.53 135.49,62.52 136.73,63.76 136.73,70.96 v136.76,70.99
  Top 0.406: v29.45,25.27 33.58,29.4 v135.18,29.4
  Top 0.6: TP21.TP v29.45,25.27
  Bottom 0.3: v136.76,70.99 132.63,70.99 132.36,71.27 IC4.7
  Bottom 0.4: R5.2 22.78,23.68 18.34,23.68 R2.2
  Bottom 0.5: v135.18,29.4 135.49,29.72 v135.49,33.53
  Bottom 0.6: v29.45,25.27 27.8,25.27 D10.C
  Bottom 0.8: R5.2 24.98,25.11 C9.1 26.09,25.09 26.54,25.54 D10.C
OV_OC  (via drill 0.5)
  Top 0.406: v124.23,74.63 101.2,74.63 v98.89,76.93
  Bottom 0.3: v124.23,74.63 125.59,75.98 | v98.89,76.93 98.89,77.55 88.62,87.82 76.44,87.82 73.43,84.81 Q2.3
  Bottom 0.305: IC4.6 131.7,73.01 133,74.31 133,75.6 R50.2 131.92,76.68 130.34,76.68 129.69,76.03 125.63,76.03 125.59,75.98
  Bottom 0.6: Q2.3 72.16,83.06 67.65,78.54 67.65,75.95 65.76,74.07 62.13,74.07 59.78,71.72 Q3.3
P$1
  Bottom 0.3: U$4.8 U$4.7
PWR_STATUS  (via drill 0.5 pad 1)
  Top 0.3: v71.04,90.36 70.72,90.36 | 102.12,92.16 102.12,96.81 | 132.29,69.09 v134.22,69.09
  Top 0.406: v15.79,96.71 15.79,101.47 17.06,102.74 58.34,102.74 70.72,90.36 | 102.12,92.16 93.33,92.16 90.42,95.07 86.22,95.07 81.2,90.04 v80.56,90.04 | 102.12,96.81 103.06,97.74 107.22,97.74 108.78,96.19 108.78,92.6 132.29,69.09
  Bottom 0.3: D16.C 15.79,93.27 v15.79,96.71 | 80.25,90.36 v80.56,90.04 | v134.22,69.09 132.63,69.09 131.05,67.5 131.05,66.18 IC4.12
  Bottom 0.406: 80.25,90.36 v71.04,90.36
  Bottom 0.8: D16.C 20.5,91.05 U$4.1
RCK  (via drill 0.5 pad 1)
  Top 0.6: v86.92,78.93 92.42,78.93 100.25,86.77 v100.35,86.77
  Bottom 0.6: v86.92,78.93 SV1.4 | v100.35,86.77 100.35,86.8 102.47,88.92 102.47,89.72 102.79,90.04 WEMOS1.D4
RCK_EIO  (via drill 0.5 pad 1)
  Top 0.6: v122.05,52.05 111.89,52.05 v108.5,55.44
  Bottom 0.6: WEMOS1.D8 125.02,92.58 122.05,89.62 v122.05,52.05 | v108.5,55.44 IC11.12
REL_ON  (via drill 0.5 pad 1)
  Top 0.6: R15.2 v55.48,75.75 | v125.02,63.37 117.71,63.37 | 117.71,63.37 117.39,63.37 v117.39,62.42 | v55.48,72.58 58.67,69.39 58.67,68.28 61.49,65.46 v61.49,62.6 | v61.85,58.28 v66.59,53.53 | 117.71,63.37 111.05,70.04 v109.46,70.04
  Bottom 0.6: R14.2 140.89,77.34 139.94,76.39 139.94,62.74 138.67,61.47 126.92,61.47 v125.02,63.37 | v117.39,62.42 116.66,61.68 IC11.1 | v55.48,75.75 v55.48,72.58 | v61.49,62.6 61.85,62.25 v61.85,58.28 | v66.59,53.53 92.95,53.53 v109.46,70.04
RX
  Bottom 0.6: R49.1 98.66,91.31 98.66,89.09 | 98.66,89.09 R48.1 | WEMOS1.RX 103.11,79.88 98.66,84.33 98.66,89.09
RX_IN
  Bottom 0.6: R49.2 97.24,92.58 98.34,93.69 JP2.3
SCK  (via drill 0.5 pad 1)
  Top 0.6: v100.25,84.64 92,76.39 v86.92,76.39
  Bottom 0.6: WEMOS1.D3 104.89,87.38 103.09,87.38 100.35,84.64 v100.25,84.64 | v86.92,76.39 SV1.5
SCK_EIO  (via drill 0.5 pad 1)
  Top 0.6: v123.75,51.31 122.79,51.31 122.48,51 111.03,51 v107.87,54.16
  Bottom 0.6: WEMOS1.D7 124.38,90.04 123.11,88.77 123.11,51.94 v123.75,51.31 | v107.87,54.16 IC11.11
SER_EIO
  Bottom 0.6: WEMOS1.D1 107.87,82.42 112.47,77.82 112.47,71.15 107.23,65.91 107.23,58.61 107.87,57.98 IC11.14
SER_IN  (via drill 0.5 pad 1)
  Top 0.6: v101.84,84.01 91.68,73.85 v87.23,73.85
  Bottom 0.6: WEMOS1.D2 102.79,84.96 v101.84,84.01 | v87.23,73.85 SV1.6
STATUS_1  (via drill 0.5 pad 1)
  Top 0.6: R41.2 v65.33,75.75 | v65.01,52.58 60.56,57.02 v60.56,57.34
  Bottom 0.6: IC11.2 115.17,59.24 114.52,58.59 114.52,51.29 113.58,50.35 66.91,50.35 65.01,52.26 v65.01,52.58 | v65.33,75.75 62.47,75.75 58.53,71.82 58.53,61.53 60.56,59.49 v60.56,57.34
SW_FB  (via drill 0.5 pad 1)
  Top 0.6: v36.11,61.47 36.11,58.61 TP14.TP
  Bottom 0.6: U$1.8 41.2,62.1 41.04,62.26 | 41.04,62.26 40.88,62.42 D5.C | 36.75,62.26 36.11,62.26 v36.11,61.47 | 41.04,62.26 38.5,62.26 | 38.5,62.26 36.75,62.26 | 36.75,62.26 36.11,62.9 R8.2 | R28.2 R7.1 37.7,51.14 37.7,61.47 38.5,62.26
TX
  Bottom 0.6: Q9.2 93.27,88.88 93.65,88.49 93.65,86.37 102.69,77.34 WEMOS1.TX
TX_IN
  Bottom 0.6: JP2.2 95.81,93.22 95.49,92.9 94.53,92.9 94.22,92.58 Q9.3 94.2,91.8 R47.2
UCC  (via drill 0.5 pad 1)
  Top 0.6: v38.34,74.8 41.51,71.63 47.55,71.63 v52.94,66.23
  Bottom 0.5: U$1.2 48.81,60.83 48.18,61.47 C12.1
  Bottom 0.6: R26.1 45.62,64.49 C14.1 C12.1 48.18,65.91 50.72,65.91 R6.1 50.89,67.5 53.9,67.5 54.69,66.71 | L2.1 55.48,65.91 54.69,66.71 | C4.1 18.02,71.44 18.65,72.08 35.61,72.08 v38.34,74.8 | v52.94,66.23 54.21,66.23 54.69,66.71
  Bottom 0.7: 14.84,56.39 15.16,56.07 U$2.2 | 13.89,56.39 U$2.3 13.89,52.42 R11.1
  Bottom 0.8: L3.2 17.26,85.92 | 17.26,85.92 17.26,83.69 | 17.26,83.69 C13.1 C24.1 18.5,80.5 R51.2 C23.+ | 17.26,83.69 C22.+ | TP1.TP 17.26,85.92
  Bottom 1: C23.+ 14.97,74.48 14.21,73.72 | C4.1 C6.1 | IC3.1 10.71,70.67 11.48,71.44 C6.1 | C6.1 14.21,73.72 | 14.21,73.72 14.02,73.53 9.76,73.53 6.59,70.36 6.59,61.66 C21.1 C18.1 7.73,56.84 8.18,56.39 13.89,56.39 14.84,56.39
UCC_U  (via drill 0.5 pad 1)
  Top 0.3: v29.77,76.07 30.52,75.32 | v133.59,64.64 132.58,63.64 132.58,62.37 132,61.78 v132,52.26
  Top 0.406: 30.52,75.32 30.52,39.09 37.05,32.55 109.44,32.55 v129.14,52.26
  Bottom 0.3: v129.14,52.26 v132,52.26 | v133.59,64.64 133.01,65.22 133.01,66.16 IC4.9
  Bottom 0.4: R52.2 24.21,75.12 28.81,75.12 v29.77,76.07
  Bottom 0.8: R51.1 R52.2
VN_CTRL
  Bottom 0.6: WEMOS1.D6 130.09,87.5 131.05,88.45 131.05,96.39 130.09,97.34 125.97,97.34 121.2,92.58 121.2,52.69 121,52.48 121,51.62 121.2,51.41 121.2,49.4 107.7,35.9 R32.1
VN_EN  (via drill 0.5 pad 1)
  Top 0.6: v58.34,77.66 60.08,77.66 R18.2 61.15,77.83 62.65,79.32 62.65,86.1 63.1,86.55 69.45,86.55 77.71,94.81 77.71,96.25 79.39,97.93 88.84,97.93 93.04,102.14 108.09,102.14 125.27,84.96 WEMOS1.D5
  Bottom 0.6: v58.34,77.66 58.34,73.22 56.12,70.99 53.09,70.99 R27.1
VN_I  (via drill 0.5, 0.5 pad 1)
  Top 0.3: v73.47,74.26 75.8,71.92 75.8,62.1 78.34,59.56 92.63,59.56 v100.89,67.82
  Top 0.4: v73.47,74.26 72.63,73.42 TP12.TP
  Top 0.406: v107,72.16 107.09,72.24 123.89,72.24 v124.22,71.92
  Bottom 0.3: v100.89,67.82 105.22,72.16 v107,72.16 | v124.22,71.92 126.54,74.24 130.46,74.24 131.06,73.65 IC4.5
  Bottom 0.4: IC5.1 74.85,77.66 74.59,77.4 74.59,76.22 74.13,75.76 IC5.4 73.47,75.52 v73.47,74.26
VN_I_SENSE  (via drill 0.5 pad 1)
  Top 0.4: v76.59,74.28 76.59,73.06 TP10.TP
  Bottom 0.4: Q5.3 81.35,72.58 81.35,75.43 R21.1 79,75.6 C25.1 78.81,75.79 77.63,75.79 | 77.63,75.79 77.24,75.79 | 77.24,75.79 76.38,75.79 76.34,75.76 IC5.3 | 77.63,75.79 77.63,80.28 R23.1 | v76.59,74.28 77.11,74.8 77.11,75.66 77.24,75.79
VN_NIXIE  (via drill 0.5 pad 1)
  Top 0.4: v78.03,65.28 TP7.TP
  Bottom 0.4: SV1.10 78.03,63.69 | 78.03,63.69 R19.1 75.47,63.69 74.68,64.47 74.68,68.74 75.84,69.89 IC1.3 | 78.03,63.69 v78.03,65.28
VN_NIXIE_SHUNT  (via drill 0.5 pad 1)
  Top 0.4: v71.43,62.67 71.43,64.89 TP6.TP
  Bottom 0.4: IC1.5 IC1.4 73.23,70.04 72.63,69.45 D7.C 72.63,66.73 C26.1 73.13,63.71 R19.2 | R19.2 71.5,63.69 71.43,63.62 v71.43,62.67 | R9.2 69.53,63.77 69.62,63.69 R19.2
  Bottom 0.6: C19.+ 67.23,57.66 55.68,46.11 45.38,46.11 44.05,47.44 D3.C 41.04,47.81 R7.2 | C16.1 68.18,59.88 C19.+ | C19.+ 67.23,60.2 69.53,62.5 69.53,63.77
VN_U  (via drill 0.5, 0.5 pad 1)
  Top 0.3: TP9.TP 66.28,64.96 72.31,58.93 93.58,58.93 v102.32,67.66
  Top 0.4: v64.04,68.19 64.04,65.92 TP9.TP
  Top 0.406: v124.33,70.59 123.33,70.59 122.84,71.08 108.28,71.08 v107.87,70.67
  Bottom 0.3: v102.32,67.66 105.33,70.67 v107.87,70.67 | v124.33,70.59 127.27,73.53 130.09,73.53 130.41,73.22 IC4.4
  Bottom 0.4: R55.1 64.04,67.02 | 64.04,67.02 64.58,67.02 IC6.1 | 64.04,67.02 v64.04,68.19
VN_U_SENSE  (via drill 0.5 pad 1)
  Top 0.4: v67.73,66.83 67.73,65.09 TP8.TP
  Bottom 0.4: R9.1 69.45,67.82 | 69.45,67.82 R10.2 | 69.45,67.82 67.73,67.82 | 67.73,67.82 66.91,67.82 | IC6.3 66.59,67.5 66.91,67.82 | 66.91,67.82 66.91,69.7 R25.1 | v67.73,66.83 67.73,67.82

### Text on the board
Top: 1 | Projekt BSPC - Digitronové hodiny / Řídící deska v1.0 / Martin Šťastný & Ondřej Vybíral
Bottom: 2